# Altium project STM32MP25XXAK_LPDDR4.PrjPcb (part 1 of 2)
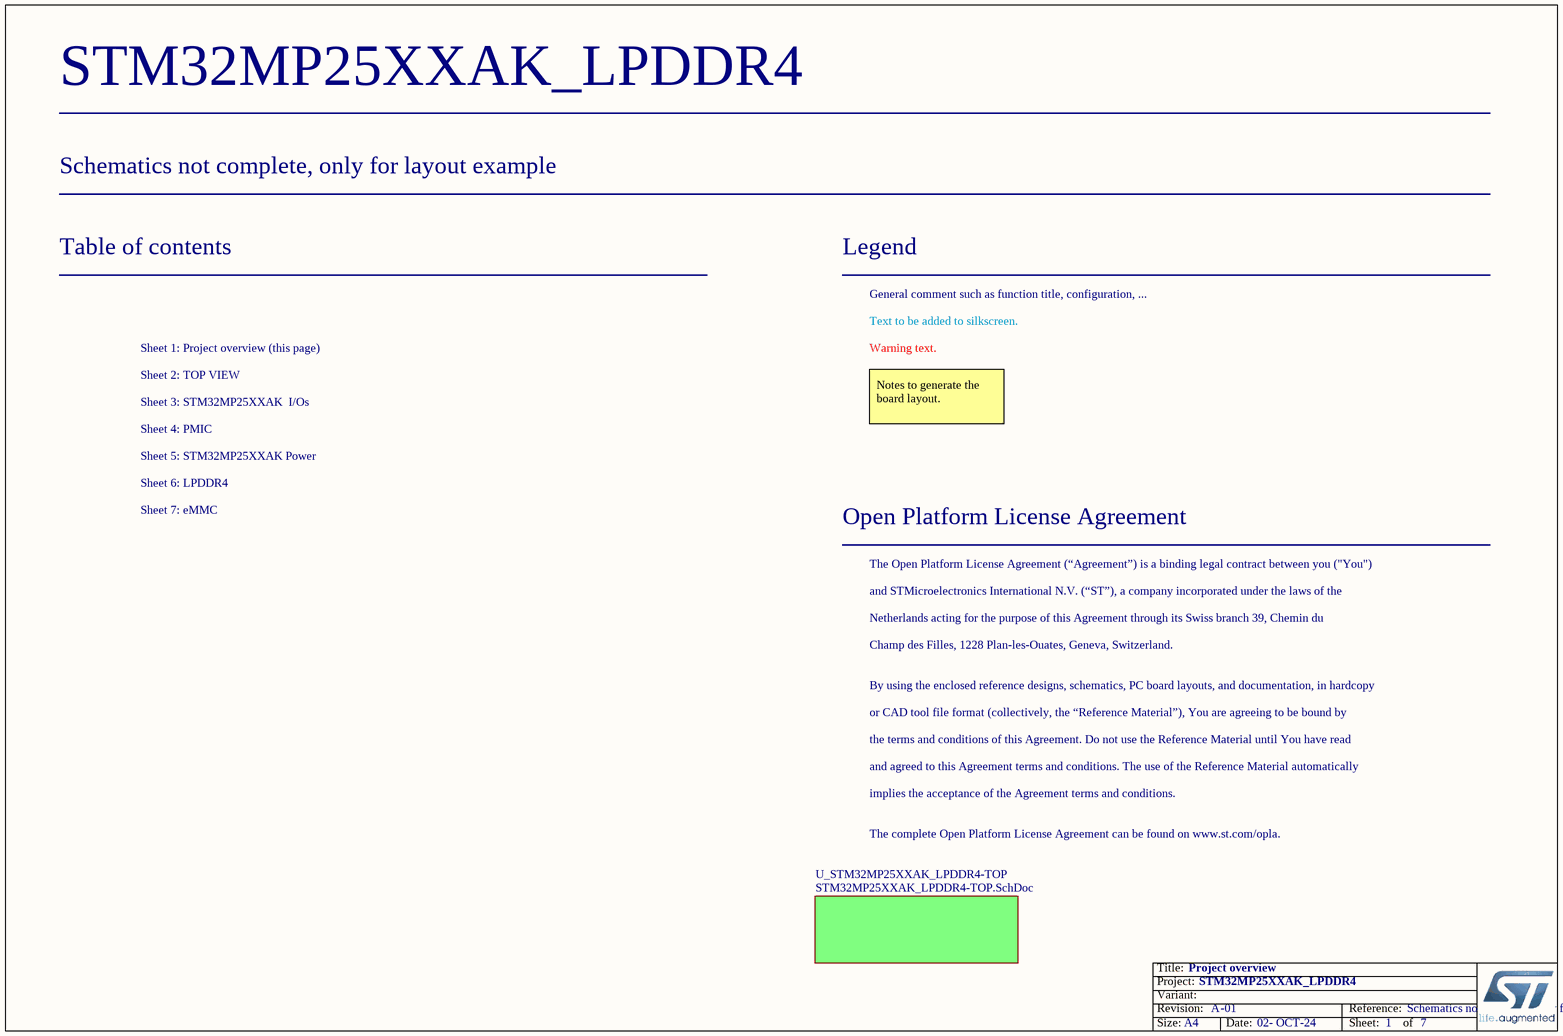
[diagram p0: STM32MP25XXAK_LPDDR4_Project_Overview.SchDoc]
Board_Reference: Schematics not complete, only for layout example; Board_PCB_Revision: A; Board_Name: STM32MP25XXAK_LPDDR4; Board_Document_Date: 02- OCT-24; Board_Assembly_Revision: 01
7 sheets, 190 parts. Net scope: flat (ports and power ports of the same name join across sheets).
Board file: STM32MP25XXAK_LPDDR4.PcbDoc
Sheets:
  STM32MP25XXAK_LPDDR4_Project_Overview.SchDoc
    U_STM32MP25XXAK_LPDDR4-TOP = STM32MP25XXAK_LPDDR4-TOP.SchDoc
      U_STM32MP25XXAK I_Os = STM32MP25XXAK I_Os.SchDoc
      U_PMIC = PMIC.SchDoc
      U_STM32MP25XXAK Power = STM32MP25XXAK Power.SchDoc
      U_LPDDR4 = LPDDR4.SchDoc
      U_eMMC = eMMC.SchDoc

## Sheet STM32MP25XXAK_LPDDR4_Project_Overview.SchDoc: Project overview
size A4; Date: Not used; ApprovedBy: Not used; CheckedBy: Not used; Author: Not used; CompanyName: STMicroelectronics; DrawnBy: Not used; Engineer: Not used; Organization: Not used; Address1: Not used; Address2: Not used; Address3: Not used; Address4: Not used; DocumentNumber: Not used; Revision: Not used; SheetNumber: 1; SheetTotal: 7; CurrentTime: Not used; CurrentDate: Not used; Time: Not used; DocumentFullPathAndName: Not used; DocumentName: Not used; ModifiedDate: Not used; ImagePath: Not used; ProjectName: Not used; Application_BuildNumber: Not used

### Sub-sheets
U_STM32MP25XXAK_LPDDR4-TOP = STM32MP25XXAK_LPDDR4-TOP.SchDoc: no entries

### Notes on the sheet
- Table of contents
- Legend
- General comment such as function title, configuration, ...
- Sheet 1: Project overview (this page)
- Sheet 2: TOP VIEW
- Text to be added to silkscreen.
- Warning text.
- Sheet 3: STM32MP25XXAK  I/Os
- Sheet 4: PMIC
- Notes to generate the board layout.
- Sheet 5: STM32MP25XXAK Power
- Sheet 7: eMMC
- Sheet 6: LPDDR4
- Open Platform License Agreement
- The Open Platform License Agreement (“Agreement”) is a binding legal contract between you ("You")
- and STMicroelectronics International N.V. (“ST”), a company incorporated under the laws of the
- Netherlands acting for the purpose of this Agreement through its Swiss branch 39, Chemin du
- Champ des Filles, 1228 Plan-les-Ouates, Geneva, Switzerland.
- By using the enclosed reference designs, schematics, PC board layouts, and documentation, in hardcopy
- or CAD tool file format (collectively, the “Reference Material”), You are agreeing to be bound by
- the terms and conditions of this Agreement. Do not use the Reference Material until You have read
- and agreed to this Agreement terms and conditions. The use of the Reference Material automatically
- implies the acceptance of the Agreement terms and conditions.
- The complete Open Platform License Agreement can be found on www.st.com/opla.
- Title:
- Project:
- Size:
- Revision:
- Variant:
- A4
- -
- Date:
- Reference:
- Sheet:
- of

## Sheet STM32MP25XXAK_LPDDR4-TOP.SchDoc: STM32MP25XXAK-TOP
size A3; Date: Not used; ApprovedBy: Not used; CheckedBy: Not used; Author: Not used; CompanyName: STMicroelectronics; DrawnBy: Not used; Engineer: Not used; Organization: Not used; Address1: Not used; Address2: Not used; Address3: Not used; Address4: Not used; DocumentNumber: Not used; Revision: Not used; SheetNumber: 2; SheetTotal: 7; CurrentTime: Not used; CurrentDate: Not used; Time: Not used; DocumentFullPathAndName: Not used; DocumentName: Not used; ModifiedDate: Not used; ImagePath: Not used; ProjectName: Not used; Application_BuildNumber: Not used
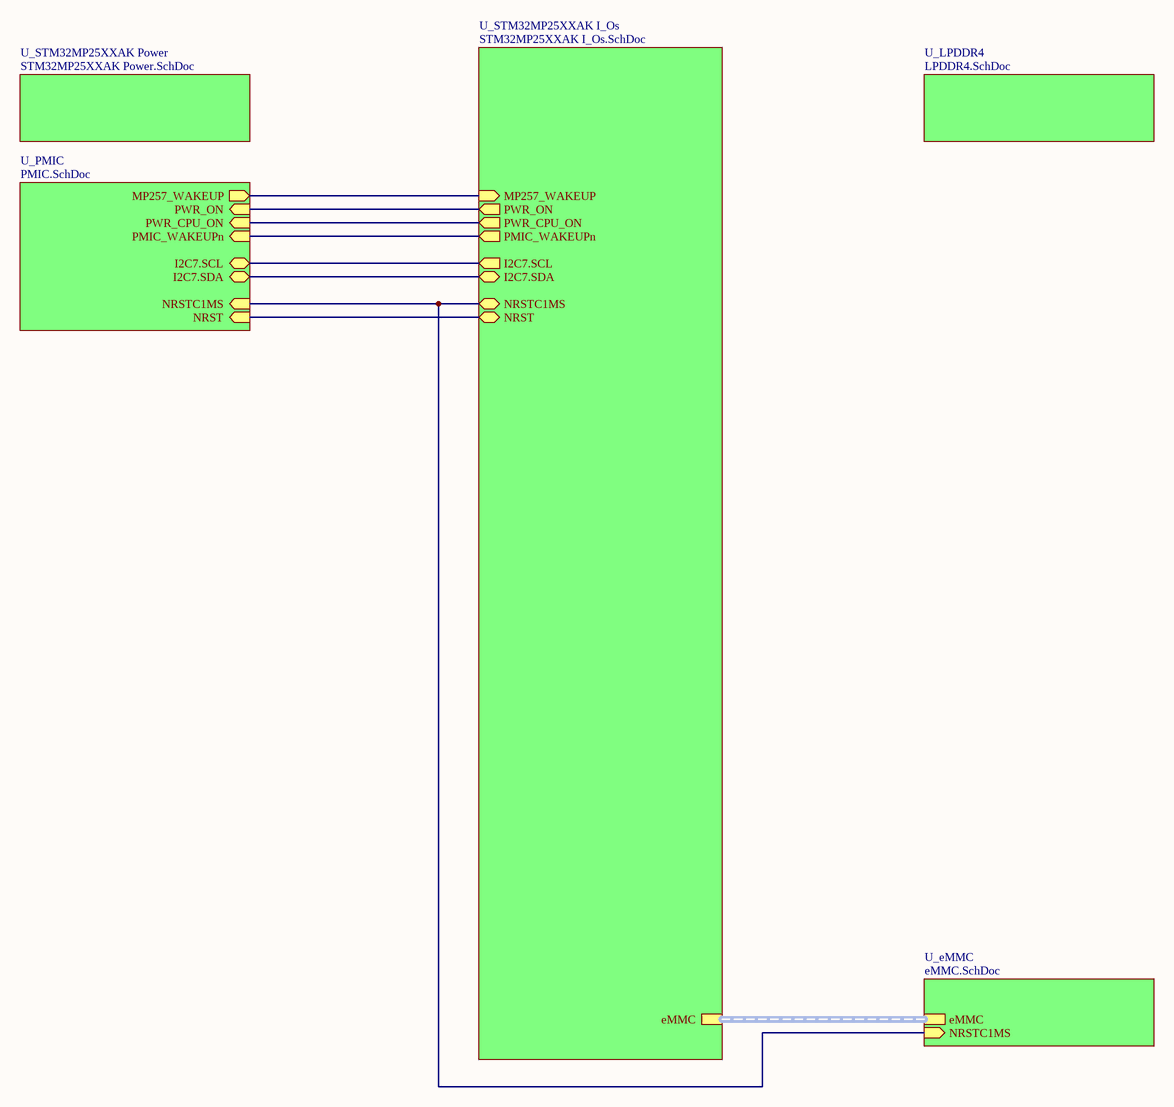
[diagram p1: STM32MP25XXAK_LPDDR4-TOP.SchDoc]

### Sub-sheets
U_eMMC = eMMC.SchDoc: eMMC (harness eMMC), NRSTC1MS (in)
U_LPDDR4 = LPDDR4.SchDoc: no entries
U_PMIC = PMIC.SchDoc: PMIC_WAKEUPn (in), NRST (in), I2C7.SCL (bidir), PWR_ON (in), PWR_CPU_ON (in), NRSTC1MS (in), I2C7.SDA (bidir), MP257_WAKEUP (out)
U_STM32MP25XXAK I_Os = STM32MP25XXAK I_Os.SchDoc: NRST (bidir), PWR_ON (out), NRSTC1MS (bidir), I2C7.SDA (bidir), I2C7.SCL (out), PWR_CPU_ON (out), MP257_WAKEUP (in), PMIC_WAKEUPn (out), eMMC (harness eMMC)
U_STM32MP25XXAK Power = STM32MP25XXAK Power.SchDoc: no entries

### Nets
(unnamed): sheet U_STM32MP25XXAK I_Os/NRST, sheet U_PMIC/NRST
(unnamed): sheet U_STM32MP25XXAK I_Os/PWR_ON, sheet U_PMIC/PWR_ON
(unnamed): sheet U_STM32MP25XXAK I_Os/NRSTC1MS, sheet U_PMIC/NRSTC1MS, sheet U_eMMC/NRSTC1MS
(unnamed): sheet U_STM32MP25XXAK I_Os/I2C7.SDA, sheet U_PMIC/I2C7.SDA
(unnamed): sheet U_STM32MP25XXAK I_Os/I2C7.SCL, sheet U_PMIC/I2C7.SCL
(unnamed): sheet U_STM32MP25XXAK I_Os/PWR_CPU_ON, sheet U_PMIC/PWR_CPU_ON
(unnamed): sheet U_STM32MP25XXAK I_Os/MP257_WAKEUP, sheet U_PMIC/MP257_WAKEUP
(unnamed): sheet U_STM32MP25XXAK I_Os/PMIC_WAKEUPn, sheet U_PMIC/PMIC_WAKEUPn

### Buses and harness runs
harness sheet U_eMMC/eMMC = sheet U_STM32MP25XXAK I_Os/eMMC

### Notes on the sheet
- Title:
- Project:
- Size:
- Revision:
- Variant:
- A3
- -
- Date:
- Reference:
- Sheet:
- of

## Sheet STM32MP25XXAK I_Os.SchDoc: STM32MP25XXAK  I/Os
size A3; Date: Not used; ApprovedBy: Not used; CheckedBy: Not used; Author: Not used; CompanyName: STMicroelectronics; DrawnBy: Not used; Engineer: Not used; Organization: Not used; Address1: Not used; Address2: Not used; Address3: Not used; Address4: Not used; DocumentNumber: Not used; Revision: Not used; SheetNumber: 3; SheetTotal: 7; CurrentTime: Not used; CurrentDate: Not used; Time: Not used; DocumentFullPathAndName: Not used; DocumentName: Not used; ModifiedDate: Not used; ImagePath: Not used; ProjectName: Not used; Application_BuildNumber: Not used
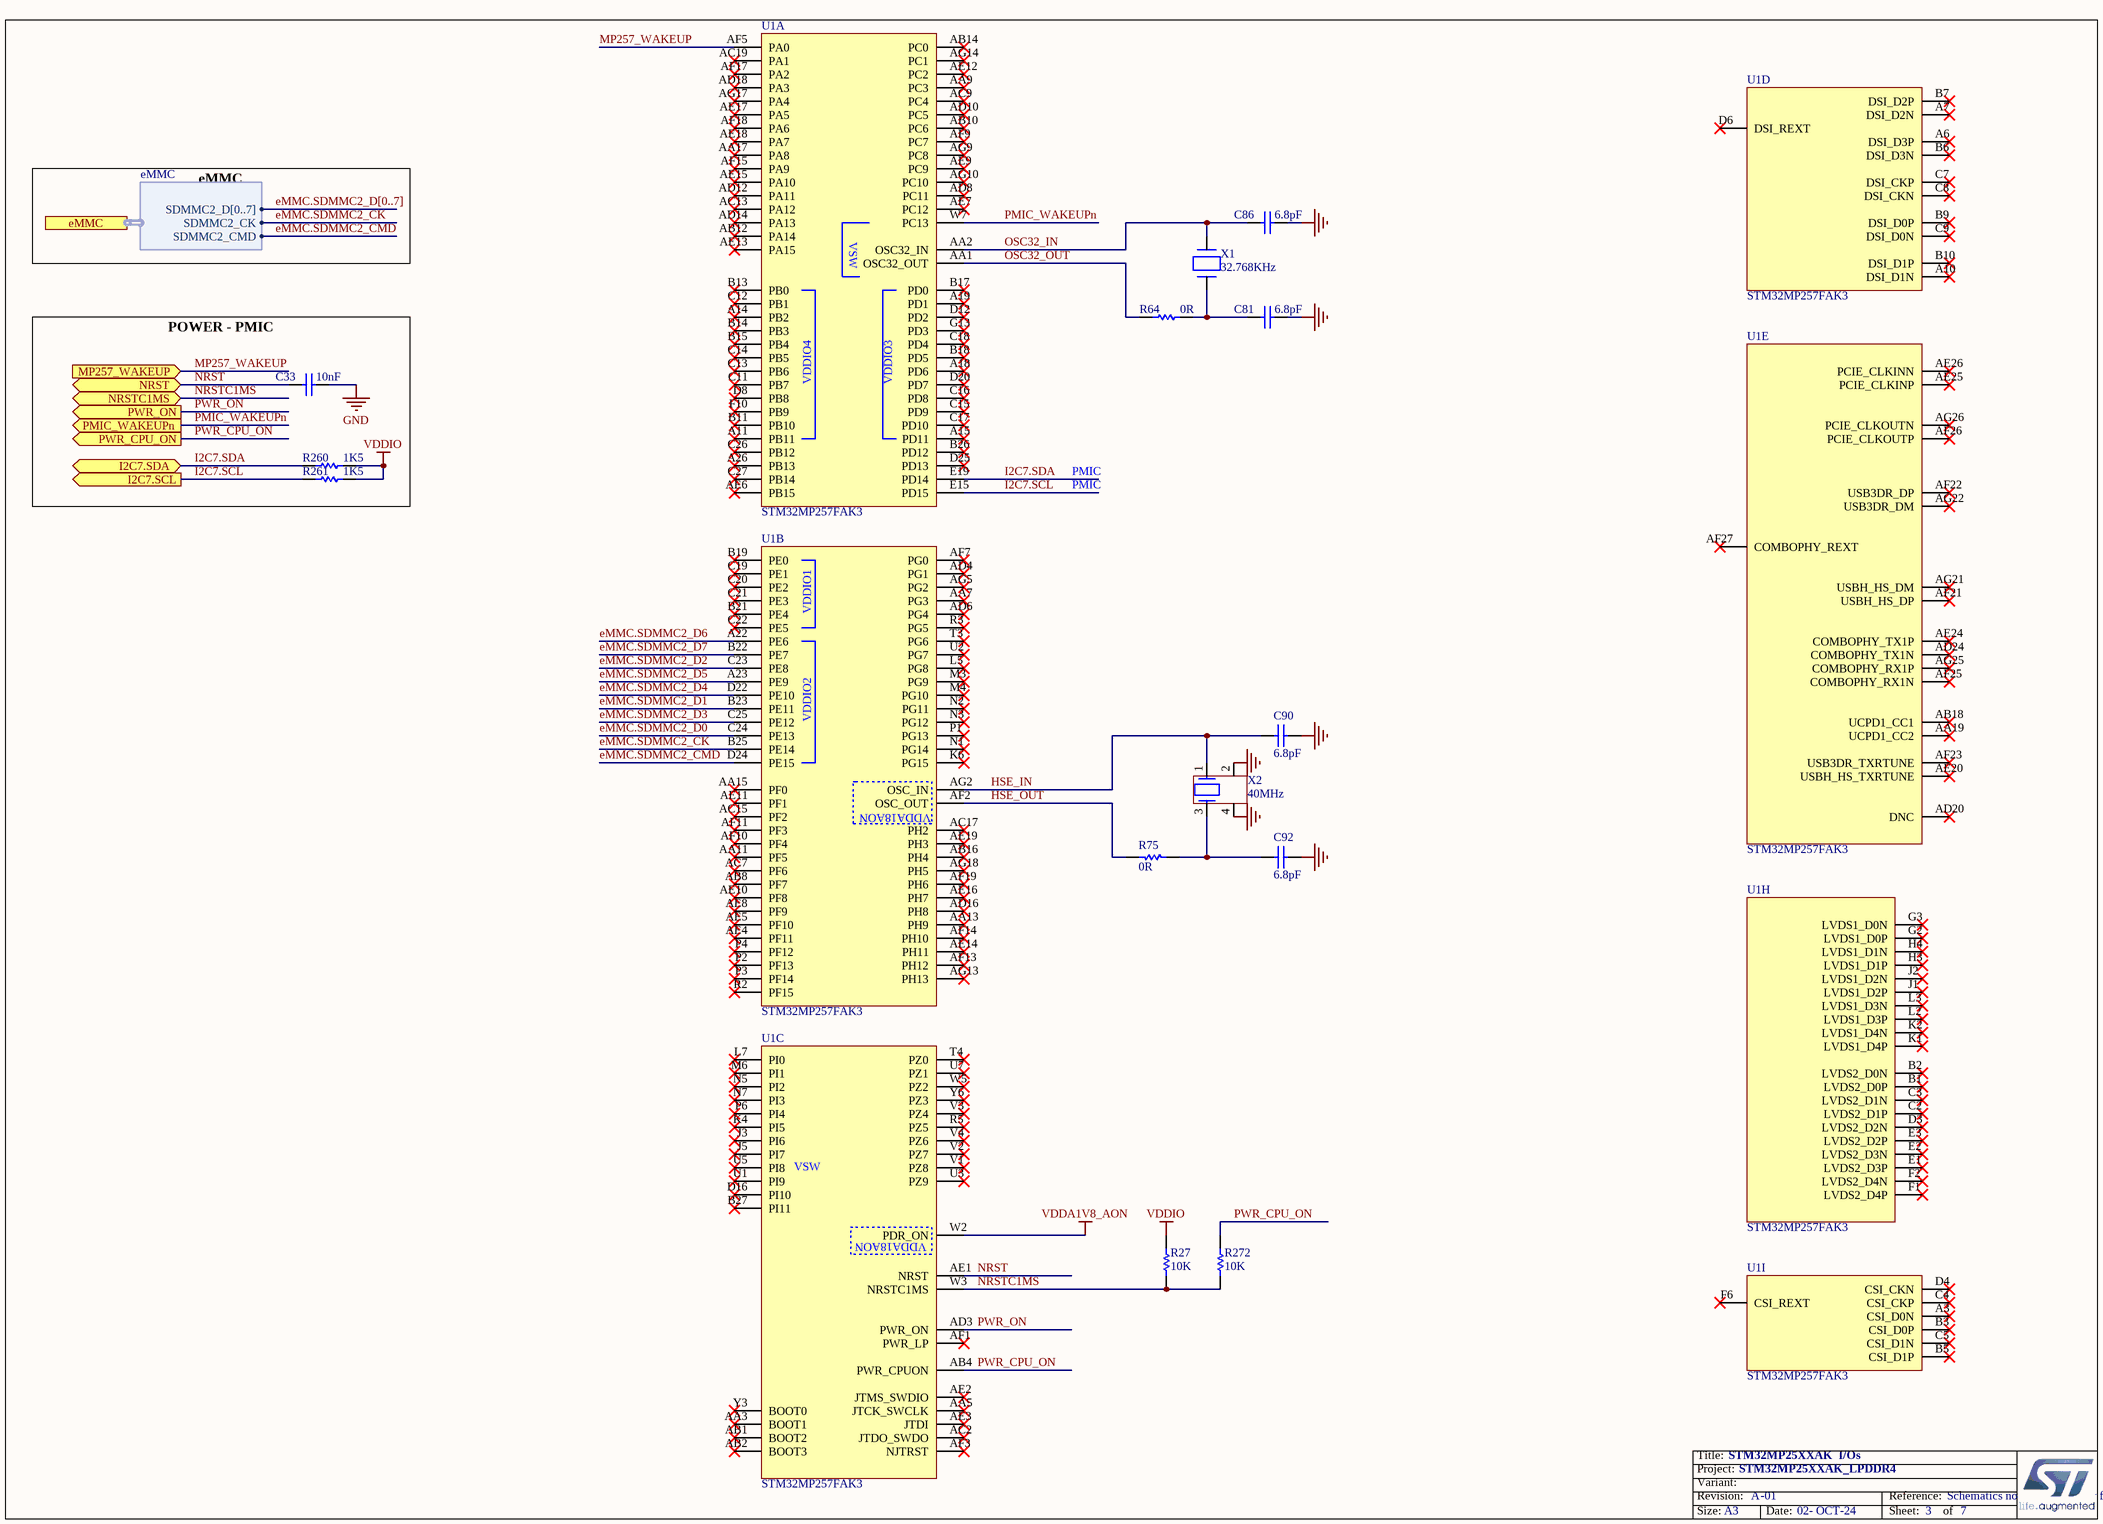
[diagram p2: STM32MP25XXAK I_Os.SchDoc]

### Parts
C33  value 10nF  [C0402]  (hidden comment: Capacitor)
C81  value 6.8pF  [C0402]  (hidden comment: Capacitor)
C86  value 6.8pF  [C0402]  (hidden comment: Capacitor)
C90  value 6.8pF  [C0402]  (hidden comment: Capacitor)
C92  value 6.8pF  [C0402]  (hidden comment: Capacitor)
R27  value 10K  [R0402]  (hidden comment: Resistor)
R64  value 0R  [R0402]
R75  value 0R  [R0402]
R260  value 1K5  [R0402]  (hidden comment: Resistor)
R261  value 1K5  [R0402]  (hidden comment: Resistor)
R272  value 10K  [R0402]  (hidden comment: Resistor)
U1  STM32MP257FAK3  [ICC_TFBGA424_14X14_P050_H1P20_CODE-B0A2]  (parts A,B,C,D,E,H,I of 9)
X1  value 32.768KHz  [CRY_NX2012SA_2P]  (hidden comment: XTAL_2_PINS)
X2  value 40MHz  [CRY_NX1612SA_4P]  (hidden comment: XTAL_4_PINS)

### Ports
eMMC (harness eMMC), I2C7.SCL (out), I2C7.SDA (bidir), MP257_WAKEUP (in), NRST (bidir), NRSTC1MS (bidir), PMIC_WAKEUPn (out), PWR_CPU_ON (out), PWR_ON (out)

### Harnesses
eMMC: SDMMC2_CK, SDMMC2_CMD, SDMMC2_D[0..7]

### Nets
GND: C33.1 C81.2 C86.2 C90.1 C92.2 X2.2 X2.4
VDDA1V8_AON: U1.W2(PDR_ON)
VDDIO: R27.2 R260.2 R261.2
eMMC.SDMMC2_CK: U1.B25(PE14) ; port eMMC.SDMMC2_CK
eMMC.SDMMC2_CMD: U1.D24(PE15) ; port eMMC.SDMMC2_CMD
eMMC.SDMMC2_D0: U1.C24(PE13)
eMMC.SDMMC2_D1: U1.B23(PE11)
eMMC.SDMMC2_D2: U1.C23(PE8)
eMMC.SDMMC2_D3: U1.C25(PE12)
eMMC.SDMMC2_D4: U1.D22(PE10)
eMMC.SDMMC2_D5: U1.A23(PE9)
eMMC.SDMMC2_D6: U1.A22(PE6)
eMMC.SDMMC2_D7: U1.B22(PE7)
HSE_IN: C90.2 U1.AG2(OSC_IN) X2.1
HSE_OUT: R75.2 U1.AF2(OSC_OUT)
I2C7.SCL: R261.1 U1.E15(PD15) ; port I2C7.SCL
I2C7.SDA: R260.1 U1.E19(PD14) ; port I2C7.SDA
MP257_WAKEUP: U1.AF5(PA0) ; port MP257_WAKEUP
NRST: C33.2 U1.AE1(NRST) ; port NRST
NRSTC1MS: R27.1 R272.1 U1.W3(NRSTC1MS) ; port NRSTC1MS
OSC32_IN: C86.1 U1.AA2(OSC32_IN) X1.2(X2)
OSC32_OUT: R64.1 U1.AA1(OSC32_OUT)
PMIC_WAKEUPn: U1.W7(PC13) ; port PMIC_WAKEUPn
PWR_CPU_ON: R272.2 U1.AB4(PWR_CPUON) ; port PWR_CPU_ON
PWR_ON: U1.AD3(PWR_ON) ; port PWR_ON
NetC81_1: C81.1 R64.2 X1.1(X1)
NetC92_1: C92.1 R75.1 X2.3

Not connected (* = marked no-connect by the designer): U1 A3(CSI_D0N)* A6(DSI_D3P)* A7(DSI_D2N)* A10(DSI_D1N)* A11(PB11)* A14(PB2)* A15(PD11)* A18(PD6)* A19(PD1)* A26(PB13)* AA3(BOOT1)* AA5(JTCK_SWCLK)* AA7(PG3)* AA9(PC3)* AA11(PF5)* AA13(PH9)* AA15(PF0)* AA17(PA8)* AA19(UCPD1_CC2)* AB1(BOOT2)* AB2(BOOT3)* AB8(PF7)* AB10(PC6)* AB12(PA14)* AB14(PC0)* AB16(PH4)* AB18(UCPD1_CC1)* AC2(JTDO_SWDO)* AC7(PF6)* AC9(PC4)* AC13(PA12)* AC15(PF2)* AC17(PH2)* AC19(PA1)* AD4(PG1)* AD6(PG4)* AD8(PC11)* AD10(PC5)* AD12(PA11)* AD14(PA13)* AD16(PH8)* AD18(PA3)* AD20(DNC)* AD24(COMBOPHY_TX1N)* AE2(JTMS_SWDIO)* AE3(JTDI)* AE4(PF11)* AE5(PF10)* AE6(PB15)* AE7(PC12)* AE8(PF9)* AE9(PC9)* AE10(PF8)* AE11(PF1)* AE12(PC2)* AE13(PA15)* AE14(PH11)* AE15(PA10)* AE16(PH7)* AE17(PA5)* AE18(PA7)* AE19(PH3)* AE20(USBH_HS_TXRTUNE)* AE24(COMBOPHY_TX1P)* AE25(PCIE_CLKINP)* AE26(PCIE_CLKINN)* AF1(PWR_LP)* AF3(NJTRST)* AF7(PG0)* AF9(PC7)* AF10(PF4)* AF11(PF3)* AF13(PH12)* AF14(PH10)* AF15(PA9)* AF17(PA2)* AF18(PA6)* AF19(PH6)* AF21(USBH_HS_DP)* AF22(USB3DR_DP)* AF23(USB3DR_TXRTUNE)* AF25(COMBOPHY_RX1N)* AF26(PCIE_CLKOUTP)* AF27(COMBOPHY_REXT)* AG5(PG2)* AG9(PC8)* AG10(PC10)* AG13(PH13)* AG14(PC1)* AG17(PA4)* AG18(PH5)* AG21(USBH_HS_DM)* AG22(USB3DR_DM)* AG25(COMBOPHY_RX1P)* AG26(PCIE_CLKOUTN)* B1(LVDS2_D0P)* B2(LVDS2_D0N)* B3(CSI_D0P)* B5(CSI_D1P)* B6(DSI_D3N)* B7(DSI_D2P)* B9(DSI_D0P)* B10(DSI_D1P)* B11(PB10)* B13(PB0)* B14(PB3)* B15(PB4)* B17(PD0)* B18(PD5)* B19(PE0)* B21(PE4)* B26(PD12)* B27(PI11)* C2(LVDS2_D1P)* C3(LVDS2_D1N)* C4(CSI_CKP)* C5(CSI_D1N)* C7(DSI_CKP)* C8(DSI_CKN)* C9(DSI_D0N)* C11(PB7)* C12(PB1)* C13(PB6)* C14(PB5)* C15(PD9)* C16(PD8)* C17(PD10)* C18(PD4)* C19(PE1)* C20(PE2)* C21(PE3)* C22(PE5)* C26(PB12)* C27(PB14)* D3(LVDS2_D2N)* D4(CSI_CKN)* D6(DSI_REXT)* D8(PB8)* D12(PD2)* D16(PI10)* D20(PD7)* D25(PD13)* E1(LVDS2_D3P)* E2(LVDS2_D3N)* E3(LVDS2_D2P)* F1(LVDS2_D4P)* F2(LVDS2_D4N)* F6(CSI_REXT)* F10(PB9)* G2(LVDS1_D0P)* G3(LVDS1_D0N)* G13(PD3)* H3(LVDS1_D1P)* H4(LVDS1_D1N)* J1(LVDS1_D2P)* J2(LVDS1_D2N)* J3(PI6)* J5(PI7)* K1(LVDS1_D4P)* K2(LVDS1_D4N)* K4(PI5)* K6(PG15)* L2(LVDS1_D3P)* L3(LVDS1_D3N)* L5(PG8)* L7(PI0)* M3(PG9)* M4(PG10)* M6(PI1)* N1(PG14)* N2(PG11)* N3(PG12)* N5(PI2)* N7(PI3)* P1(PG13)* P2(PF13)* P3(PF14)* P4(PF12)* P6(PI4)* R2(PF15)* R3(PG5)* R5(PZ5)* T3(PG6)* T4(PZ0)* U1(PI9)* U2(PG7)* U3(PZ9)* U5(PI8)* U7(PZ1)* V1(PZ8)* V2(PZ7)* V3(PZ4)* V4(PZ6)* W5(PZ2)* Y3(BOOT0)* Y6(PZ3)*

### Buses and harness runs
bus eMMC.SDMMC2_D[0..7]

### Notes on the sheet
- eMMC
- POWER - PMIC
- PMIC
- Title:
- Project:
- Size:
- Revision:
- Variant:
- A3
- -
- Date:
- Reference:
- Sheet:
- of
- (in symbol MCD-03375, part A) VSW
- (in symbol MCD-03375, part C) VSW

### Library data of the parts
C33 = MCD-00011: Capacitor, MLCC, 10nF, 16V, X7R, 10%, 0402, T=0.5mm; Manufacturer_Part_Number: CC0402KRX7R7BB103; Manufacturer: YAGEO; Provided_By: SUBCO; Initial_Board_Reference: MB1274; Internal_Part_Number: MCD-00011; Status: Released; Part_Type: Capacitor; Package: C0402; ComponentLink1Description: Datasheet; ComponentLink1URL: http://tunmcdsvn.tun.st.com/Component_Datasheet_Library/Trunk/Capacitors/Yageo_Multilayer_Capacitor_X7R_series_100pF_to_22uF; ECCN_US: n/a; ECCN_EU: n/a
C81 C86 = MCD-00674: Capacitor, MLCC, 6.8pF, 50V, NPO, +-0.25pF, 0402, T=0.5mm; Manufacturer_Part_Number: CC0402CRNPO9BN6R8; Manufacturer: YAGEO; Part_Preference: Recommended; Provided_By: SUBCO; Initial_Board_Reference: MB1319; Path: ws/MCD_ApplicationBoards/Lists/MCDPARTSdatabase; Item Type: Item; Component_Country_Of_Origin: China; ID: 3068; ShowFields: YES; Internal_Part_Number: MCD-00674; Status: Released; Part_Type: Capacitor; Package: 0402; ComponentLink1Description: Datasheet; ComponentLink1URL: http://tunmcdsvn.tun.st.com/Component_Documentation_Library/Trunk/Capacitor/YAGEO_NP0_Series; Alternate_Manufacturer: N/A; Alternate_Manufacturer_Part_Number: N/A; Order_Code_Digikey: 311-3327-1-ND; Order_Code_Farnell: N/A; Order_Code_RS: N/A
C90 C92 = MCD-00674: Capacitor, MLCC, 6.8pF, 50V, NPO, +-0.25pF, 0402, T=0.5mm; Manufacturer_Part_Number: CC0402CRNPO9BN6R8; Manufacturer: YAGEO; Part_Preference: Recommended; Provided_By: SUBCO; Initial_Board_Reference: MB1319; Component_Country_Of_Origin: China; ID: 3068; ShowFields: YES; Internal_Part_Number: MCD-00674; Status: Released; Part_Type: Capacitor; Package: 0402; ComponentLink1Description: Datasheet; ComponentLink1URL: http://tunmcdsvn.tun.st.com/Component_Documentation_Library/Trunk/Capacitor/YAGEO_NP0_Series; ECCN_US: n/a; ECCN_EU: n/a; Alternate_Manufacturer: N/A; Alternate_Manufacturer_Part_Number: N/A; Order_Code_Digikey: 311-3327-1-ND; Order_Code_Farnell: N/A; Order_Code_RS: N/A
R27 R272 = MCD-00053: Resistor,10K,0402,1%,1/16W; BMS_Part_Number: 9131590; Part_Preference: Recommended; Manufacturer: YAGEO; Manufacturer_Part_Number: RC0402FR-0710KL; Component_Country_Of_Origin: China; ID: 2539; ShowFields: YES; Internal_Part_Number: MCD-00053; Status: Released; Part_Type: Resistor; Package: 0402; ComponentLink1Description: Datasheet; ComponentLink1URL: http://tunmcdsvn.tun.st.com/Component_Documentation_Library/Trunk/Resistor/YAGEO_RC_L_Series; Order_Code_Digikey: 311-10.0KLRCT-ND; Order_Code_Farnell: 9239359; Order_Code_RS: N/A; Alternate_Manufacturer: N/A; Alternate_Manufacturer_Part_Number: N/A
R64 R75 = MCD-00052: Resistor,0R,0402,5%,1/16W; Manufacturer_Part_Number: RC0402JR-070RL; Manufacturer: YAGEO; Part_Preference: Recommended; Provided_By: SUBCO; Initial_Board_Reference: mb1274; Order_Code_RS: 618-5804; Component_Country_Of_Origin: China; ID: 2540; ShowFields: YES; Internal_Part_Number: MCD-00052; ComponentLink1Description: Datasheet; ECCN_US: n/a; ECCN_EU: n/a; Status: Released; Part_Type: Resistor; ComponentLink1URL: http://tunmcdsvn.tun.st.com/Component_Documentation_Library/Trunk/Resistor/YAGEO_RC_L_Series; Package: 0402; Alternate_Manufacturer: N/A; Alternate_Manufacturer_Part_Number: N/A; Order_Code_Digikey: 311-0.0JRCT-ND; Order_Code_Farnell: 9232516RL
R260 R261 = MCD-00068: Resistor,1K5,0402,1%,1/16W; Part_Preference: Recommended; Manufacturer: YAGEO; Manufacturer_Part_Number: RC0402FR-071K5L; Component_Country_Of_Origin: China; ID: 2524; ShowFields: YES; Internal_Part_Number: MCD-00068; Status: Released; Part_Type: Resistor; Package: 0402; ComponentLink1Description: Datasheet; ComponentLink1URL: http://tunmcdsvn.tun.st.com/Component_Documentation_Library/Trunk/Resistor/YAGEO_RC_L_Series; Order_Code_Digikey: 311-1.50KLRCT-ND; Order_Code_Farnell: 9239251; Order_Code_RS: N/A
U1 = MCD-03375: MPU , 2xCortex-A35@1.5GHz, Cortex-M33@400MHz, TFBGA 14x14, pitch 0.5, 808 KB SRAM, With Crypto; Part_Type: IC; Part_Preference: Recommended; Manufacturer: STMICROELECTRONICS; Component_Country_Of_Origin: Unknown; ShowFields: YES; ID: 5491; Internal_Part_Number: MCD-03375; Value: STM32MP257FAK3; Status: Checked; Manufacturer_Part_Number: STM32MP257FAK3; Package: TFBGA; ComponentLink1URL: http://tunmcdsvn.tun.st.com/Component_Documentation_Library/Trunk/IC/STMICROELECTRONICS_STM32MP257FAK3; Order_Code_Digikey: N/A; Order_Code_Farnell: N/A; Order_Code_RS: N/A
X1 = MCD-01479: Crystal, 32.768kHz, 6pF, +/-20ppm, 80K, 2.05x1.2mm; BMS_Part_Number: 9157049; Part_Type: Crystal_Osc; Part_Preference: Recommended; Manufacturer: NDK; Manufacturer_Part_Number: NX2012SA-32.768KHZ-EXS00A-MU00527; Component_Country_Of_Origin: Unknown; ShowFields: YES; ID: 3579; Internal_Part_Number: MCD-01479; Status: Released; Package: 2.05x1.2mm; ComponentLink1URL: http://tunmcdsvn.tun.st.com/Component_Documentation_Library/Trunk/Crytal_Oscillator/NDK_NX2012SA_Series; Order_Code_Digikey: 644-1352; Order_Code_Farnell: N/A; Order_Code_RS: N/A
X2 = MCD-02344: Crystal, 40MHz, 6pF, +/-20ppm, 80R, 1.6x1.2mm; Part_Type: Crystal_Osc; Part_Preference: Recommended; Manufacturer: NDK; Manufacturer_Part_Number: NX1612SA-40MHZ-EXS00A-CS13836; Component_Country_Of_Origin: Unknown; ShowFields: YES; ID: 4450; Internal_Part_Number: MCD-02344; Status: Checked; Package: 1.6x1.2mm; ComponentLink1URL: http://tunmcdsvn.tun.st.com/Component_Documentation_Library/Trunk/Crytal_Oscillator/NDK_NX1612SA_Series/; Order_Code_Digikey: N/A; Order_Code_Farnell: N/A; Order_Code_RS: N/A

## Sheet PMIC.SchDoc: Power PMIC
size A3; Date: Not used; ApprovedBy: Not used; CheckedBy: Not used; Author: Not used; CompanyName: STMicroelectronics; DrawnBy: Not used; Engineer: Not used; Organization: Not used; Address1: Not used; Address2: Not used; Address3: Not used; Address4: Not used; DocumentNumber: Not used; Revision: Not used; SheetNumber: 4; SheetTotal: 7; CurrentTime: Not used; CurrentDate: Not used; Time: Not used; DocumentFullPathAndName: Not used; DocumentName: Not used; ModifiedDate: Not used; ImagePath: Not used; ProjectName: Not used; Application_BuildNumber: Not used
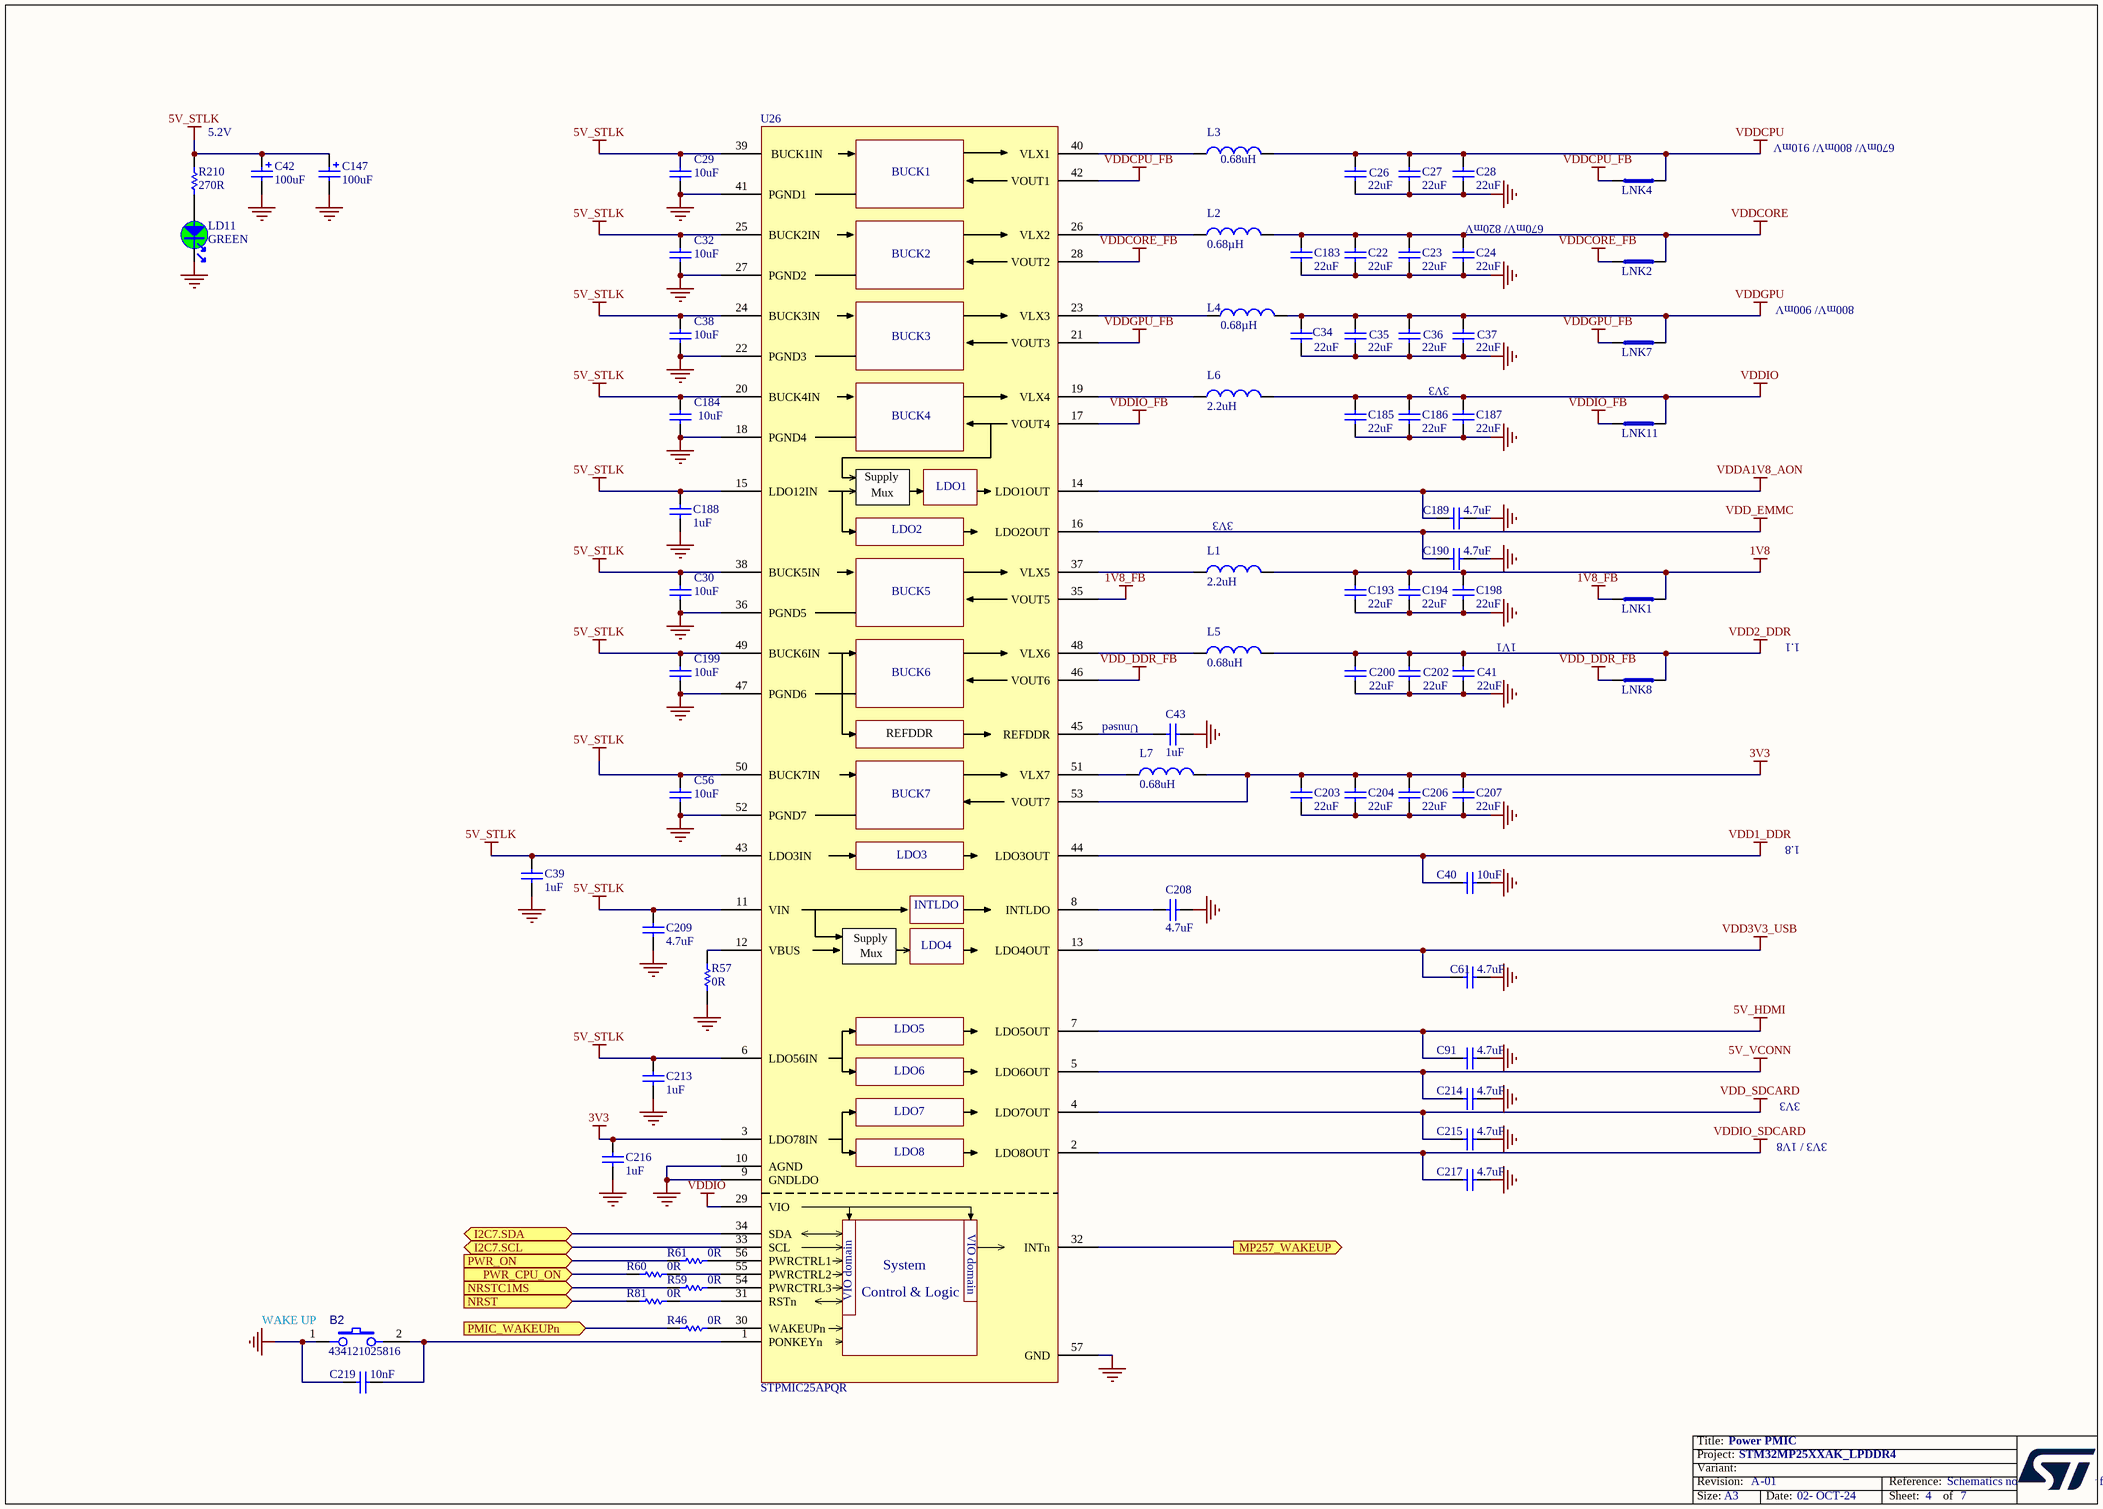
[diagram p3: PMIC.SchDoc]

### Parts
B2  value 434121025816  [SWI_WE_434121025816]  (hidden comment: SW_PUSH_SMD_2P)
C22  value 22uF  [C0603]  (hidden comment: Capacitor)
C23  value 22uF  [C0603]  (hidden comment: Capacitor)
C24  value 22uF  [C0603]  (hidden comment: Capacitor)
C26  value 22uF  [C0603]  (hidden comment: Capacitor)
C27  value 22uF  [C0603]  (hidden comment: Capacitor)
C28  value 22uF  [C0603]  (hidden comment: Capacitor)
C29  value 10uF  [C0603]  (hidden comment: Capacitor)
C30  value 10uF  [C0603]  (hidden comment: Capacitor)
C32  value 10uF  [C0603]  (hidden comment: Capacitor)
C34  value 22uF  [C0603]  (hidden comment: Capacitor)
C35  value 22uF  [C0603]  (hidden comment: Capacitor)
C36  value 22uF  [C0603]  (hidden comment: Capacitor)
C37  value 22uF  [C0603]  (hidden comment: Capacitor)
C38  value 10uF  [C0603]  (hidden comment: Capacitor)
C39  value 1uF  [C0402]  (hidden comment: Capacitor)
C40  value 10uF  [C0402]  (hidden comment: Capacitor)
C41  value 22uF  [C0603]  (hidden comment: Capacitor)
C42  value 100uF  [CPOL_TCJ-B_1210_H210]  (hidden comment: Cap_POL_TANA)
C43  value 1uF  [C0402]  (hidden comment: Capacitor)
C56  value 10uF  [C0603]  (hidden comment: Capacitor)
C61  value 4.7uF  [C0402]  (hidden comment: Capacitor)
C91  value 4.7uF  [C0402]  (hidden comment: Capacitor)
C147  value 100uF  [CPOL_TCJ-B_1210_H210]  (hidden comment: Cap_POL_TANA)
C183  value 22uF  [C0603]  (hidden comment: Capacitor)
C184  value 10uF  [C0603]  (hidden comment: Capacitor)
C185  value 22uF  [C0805]  (hidden comment: Capacitor)
C186  value 22uF  [C0805]  (hidden comment: Capacitor)
C187  value 22uF  [C0805]  (hidden comment: Capacitor)
C188  value 1uF  [C0402]  (hidden comment: Capacitor)
C189  value 4.7uF  [C0402]  (hidden comment: Capacitor)
C190  value 4.7uF  [C0402]  (hidden comment: Capacitor)
C193  value 22uF  [C0805]  (hidden comment: Capacitor)
C194  value 22uF  [C0805]  (hidden comment: Capacitor)
C198  value 22uF  [C0805]  (hidden comment: Capacitor)
C199  value 10uF  [C0603]  (hidden comment: Capacitor)
C200  value 22uF  [C0603]  (hidden comment: Capacitor)
C202  value 22uF  [C0603]  (hidden comment: Capacitor)
C203  value 22uF  [C0805]  (hidden comment: Capacitor)
C204  value 22uF  [C0805]  (hidden comment: Capacitor)
C206  value 22uF  [C0805]  (hidden comment: Capacitor)
C207  value 22uF  [C0805]  (hidden comment: Capacitor)
C208  value 4.7uF  [C0402]  (hidden comment: Capacitor)
C209  value 4.7uF  [C0402]  (hidden comment: Capacitor)
C213  value 1uF  [C0402]  (hidden comment: Capacitor)
C214  value 4.7uF  [C0402]  (hidden comment: Capacitor)
C215  value 4.7uF  [C0402]  (hidden comment: Capacitor)
C216  value 1uF  [C0402]  (hidden comment: Capacitor)
C217  value 4.7uF  [C0402]  (hidden comment: Capacitor)
C219  value 10nF  [C0402]  (hidden comment: Capacitor)
L1  value 2.2uH  [IND_2016_MURATA_LQM2MPN2R2NG0]  (hidden comment: Inductor)
L2  value 0.68µH  [IND_2520_TOKO_DFE252012P]  (hidden comment: Inductor)
L3  value 0.68uH  [IND_2016_MURATA_LQM2MPN2R2NG0]  (hidden comment: Inductor)
L4  value 0.68µH  [IND_2520_TOKO_DFE252012P]  (hidden comment: Inductor)
L5  value 0.68uH  [IND_2016_MURATA_LQM2MPN2R2NG0]  (hidden comment: Inductor)
L6  value 2.2uH  [IND_2016_MURATA_LQM2MPN2R2NG0]  (hidden comment: Inductor)
L7  value 0.68uH  [IND_2016_MURATA_LQM2MPN2R2NG0]  (hidden comment: Inductor)
LD11  value GREEN  [LED_0603_OSRAM_LG-Q396-PS-35_GREEN_1A2K_H0P4]  (hidden comment: LED_green)
LNK1  link_200  [LINK200]  (value not drawn)  (no BOM)
LNK2  link_200  [LINK200]  (value not drawn)  (no BOM)
LNK4  link_200  [LINK200]  (value not drawn)  (no BOM)
LNK7  link_200  [LINK200]  (value not drawn)  (no BOM)
LNK8  link_200  [LINK200]  (value not drawn)  (no BOM)
LNK11  link_200  [LINK200]  (value not drawn)  (no BOM)
R46  value 0R  [R0402]
R57  value 0R  [R0402]
R59  value 0R  [R0402]
R60  value 0R  [R0402]
R61  value 0R  [R0402]
R81  value 0R  [R0402]
R210  value 270R  [R0402]  (hidden comment: Resistor)
U26  STPMIC25APQR  [ICC_QFN56-EPAD_6P5X6P5_P040]

### Ports
I2C7.SCL (bidir), I2C7.SDA (bidir), MP257_WAKEUP (out), NRST (in), NRSTC1MS (in), PMIC_WAKEUPn (in), PWR_CPU_ON (in), PWR_ON (in)

### Nets
1V8: C193.2 C194.2 C198.2 L1.2 LNK1.2
1V8_FB: LNK1.1 U26.35(VOUT5)
3V3: C203.2 C204.2 C206.2 C207.2 C216.2 L7.2 U26.3(LDO78IN) U26.53(VOUT7)
5V_HDMI: C91.1 U26.7(LDO5OUT)
5V_STLK: C29.2 C30.2 C32.2 C38.2 C39.2 C42.1 C56.2 C147.1 C184.2 C188.2 C199.2 C209.2 C213.2 R210.1 U26.6(LDO56IN) U26.11(VIN) U26.15(LDO12IN) U26.20(BUCK4IN) U26.24(BUCK3IN) U26.25(BUCK2IN) U26.38(BUCK5IN) U26.39(BUCK1IN) U26.43(LDO3IN) U26.49(BUCK6IN) U26.50(BUCK7IN)
5V_VCONN: C214.1 U26.5(LDO6OUT)
GND: B2.1 C22.1 C23.1 C24.1 C26.1 C27.1 C28.1 C29.1 C30.1 C32.1 C34.1 C35.1 C36.1 C37.1 C38.1 C39.1 C40.1 C41.1 C42.2 C43.1 C56.1 C61.1 C91.2 C147.2 C183.1 C184.1 C185.1 C186.1 C187.1 C188.1 C189.1 C190.2 C193.1 C194.1 C198.1 C199.1 C200.1 C202.1 C203.1 C204.1 C206.1 C207.1 C208.2 C209.1 C213.1 C214.2 C215.2 C216.1 C217.2 C219.1 LD11.2 R57.1 U26.9(GNDLDO) U26.10(AGND) U26.18(PGND4) U26.22(PGND3) U26.27(PGND2) U26.36(PGND5) U26.41(PGND1) U26.47(PGND6) U26.52(PGND7) U26.57(GND)
VDD1_DDR: C40.2 U26.44(LDO3OUT)
VDD2_DDR: C41.2 C200.2 C202.2 L5.2 LNK8.2
VDD3V3_USB: C61.2 U26.13(LDO4OUT)
VDD_DDR_FB: LNK8.1 U26.46(VOUT6)
VDD_EMMC: C190.1 U26.16(LDO2OUT)
VDD_SDCARD: C215.1 U26.4(LDO7OUT)
VDDA1V8_AON: C189.2 U26.14(LDO1OUT)
VDDCORE: C22.2 C23.2 C24.2 C183.2 L2.2 LNK2.2
VDDCORE_FB: LNK2.1 U26.28(VOUT2)
VDDCPU: C26.2 C27.2 C28.2 L3.2 LNK4.1
VDDCPU_FB: LNK4.2 U26.42(VOUT1)
VDDGPU: C34.2 C35.2 C36.2 C37.2 L4.2 LNK7.2
VDDGPU_FB: LNK7.1 U26.21(VOUT3)
VDDIO: C185.2 C186.2 C187.2 L6.2 LNK11.2 U26.29(VIO)
VDDIO_FB: LNK11.1 U26.17(VOUT4)
VDDIO_SDCARD: C217.1 U26.2(LDO8OUT)
I2C7.SCL: U26.33(SCL) ; port I2C7.SCL
I2C7.SDA: U26.34(SDA) ; port I2C7.SDA
MP257_WAKEUP: U26.32(INTn) ; port MP257_WAKEUP
NRST: R81.1 ; port NRST
NRSTC1MS: R59.1 ; port NRSTC1MS
PMIC_WAKEUPn: R46.1 ; port PMIC_WAKEUPn
PWR_CPU_ON: R60.1 ; port PWR_CPU_ON
PWR_ON: R61.1 ; port PWR_ON
NetB2_2: B2.2 C219.2 U26.1(PONKEYn)
NetC43_2: C43.2 U26.45(REFDDR)
NetC208_1: C208.1 U26.8(INTLDO)
NetL1_1: L1.1 U26.37(VLX5)
NetL2_1: L2.1 U26.26(VLX2)
NetL3_1: L3.1 U26.40(VLX1)
NetL4_1: L4.1 U26.23(VLX3)
NetL5_1: L5.1 U26.48(VLX6)
NetL6_1: L6.1 U26.19(VLX4)
NetL7_1: L7.1 U26.51(VLX7)
NetLD11_1: LD11.1 R210.2
NetR46_2: R46.2 U26.30(WAKEUPn)
NetR57_2: R57.2 U26.12(VBUS)
NetR59_2: R59.2 U26.54(PWRCTRL3)
NetR60_2: R60.2 U26.55(PWRCTRL2)
NetR61_2: R61.2 U26.56(PWRCTRL1)
NetR81_2: R81.2 U26.31(RSTn)

### Notes on the sheet
- 5.2V
- 670mV/ 800mV/ 910mV
- (near C24) 670mV/ 820mV
- 800mV/ 900mV
- 3V3
- (near L1) 3V3
- 1V1
- 1.1
- Unused
- 1.8
- 3V3 / 1V8
- (near B2) WAKE UP
- Title:
- Project:
- Size:
- Revision:
- Variant:
- A3
- -
- Date:
- Reference:
- Sheet:
- of
- (in symbol MCD-03000) BUCK1; BUCK2; BUCK3; BUCK4; Supply; LDO1; Mux; LDO2; BUCK5; BUCK6; BUCK7; LDO3; LDO4; LDO5; LDO6; LDO7; LDO8; VIO domain; System; Control & Logic

### Library data of the parts
B2 = MCD-03492: Switch tactile, SPST-NO, 50mA, 12V, 6x3.8mm; Part_Type: Misc; Part_Preference: Recommended; Manufacturer: WURTH ELEKTRONIC; Component_Country_Of_Origin: China°; ShowFields: YES; ID: 5608; Internal_Part_Number: MCD-03492; Status: Checked; Manufacturer_Part_Number: 434121025816; Package: 6x3.8mm; ComponentLink1URL: http://tunmcdsvn.tun.st.com/Component_Documentation_Library/Trunk/Misc/WURTH_ELECTRONIK_434121025816; Order_Code_Digikey: 732-7045-2-ND; Order_Code_Farnell: 1867991; Order_Code_RS: N/A
C22-C24 C26 C34-C37 C41 C200 C202 = MCD-00100: Capacitor, MLCC, 22uF, 6V3, X5R, +/-20%, 0603, T=0,8mm; Manufacturer_Part_Number: GRM188R60J226MEA0J; Manufacturer: MURATA; Part_Preference: Recommended; Component_Country_Of_Origin: Japan; ID: 2766; ShowFields: YES; Internal_Part_Number: MCD-00100; Status: Released; Part_Type: Capacitor; Package: 0603; ComponentLink1Description: Part_Information; ComponentLink1URL: http://tunmcdsvn.tun.st.com/Component_Documentation_Library/Trunk/Capacitor/MURATA_GRM_Series; Order_Code_Digikey: 490-7612-2-ND; Order_Code_Farnell: N/A; Order_Code_RS: N/A; Alternate_Manufacturer: N/A; Alternate_Manufacturer_Part_Number: N/A
C27 C28 C183 = MCD-00100: Capacitor, MLCC, 22uF, 6V3, X5R, +/-20%, 0603, T=0,8mm; Part_Preference: Recommended; Manufacturer: MURATA; Manufacturer_Part_Number: GRM188R60J226MEA0J; Component_Country_Of_Origin: Japan; ID: 2766; ShowFields: YES; Internal_Part_Number: MCD-00100; Status: Released; Part_Type: Capacitor; Package: 0603; ComponentLink1URL: http://tunmcdsvn.tun.st.com/Component_Documentation_Library/Trunk/Capacitor/MURATA_GRM_Series; Order_Code_Digikey: 490-7612-2-ND; Order_Code_Farnell: N/A; Order_Code_RS: N/A; ComponentLink1Description: Part_Information; Alternate_Manufacturer: N/A; Alternate_Manufacturer_Part_Number: N/A
C29 C30 C32 C38 C56 C184 C199 = MCD-00099: Capacitor, MLCC, 10uF, 10V, X5R, +/-10%, 0603, T=0,8mm; Manufacturer_Part_Number: GRM188R61A106KE69D; Manufacturer: MURATA; Part_Preference: Recommended; Order_Code_RS: 170-6168; Component_Country_Of_Origin: Japan; ID: 2770; ShowFields: YES; Internal_Part_Number: MCD-00099; Status: Released; Part_Type: Capacitor; Package: 0603; ComponentLink1Description: Part_Information; ComponentLink1URL: http://tunmcdsvn.tun.st.com/Component_Documentation_Library/Trunk/Capacitor/MURATA_GRM_Series; Order_Code_Digikey: 490-10474-1-ND; Order_Code_Farnell: 2494233; Alternate_Manufacturer: N/A; Alternate_Manufacturer_Part_Number: N/A
C39 C43 C188 C213 C216 = MCD-00095: Capacitor, MLCC, 1uF, 25V, X5R, +/-10%, 0402, T=0.5mm; Part_Preference: Recommended; Manufacturer: MURATA; Manufacturer_Part_Number: GRM155R61E105KA12; Order_Code_RS: 846-7287; Component_Country_Of_Origin: Japan; ShowFields: YES; ID: 2772; Internal_Part_Number: MCD-00095; Status: Released; Part_Type: Capacitor; Package: 0402; ComponentLink1URL: http://tunmcdsvn.tun.st.com/Component_Documentation_Library/Trunk/Capacitor/MURATA_GRM_Series; Order_Code_Digikey: 490-10017-1-ND; Order_Code_Farnell: 2218855
C40 = MCD-03140: Capacitor, MLCC, 10uF, 6.3V, X5R, +/-20%, 0402, T=0.5mm; Part_Preference: Recommended; Manufacturer: MURATA; Manufacturer_Part_Number: GRM155R60J106ME05D; ShowFields: YES; ID: 5256; Component_Country_Of_Origin: China, Japan; Internal_Part_Number: MCD-03140; Status: Checked; Part_Type: Capacitor; Package: 0402; ComponentLink1URL: http://tunmcdsvn.tun.st.com/Component_Documentation_Library/Trunk/Capacitor/MURATA_GRM_Series; Order_Code_Digikey: 490-GRM155R60J106ME05DTR-ND; Order_Code_Farnell: 3784428; Order_Code_RS: N/A
C42 C147 = MCD-01796: Capacitor, Tantalum, 100uF, 6V3, 40mR, +/-20%,  Type_B (3528 metric), T=1.9mm; Part_Preference: Recommended; Manufacturer: AVX; Manufacturer_Part_Number: TCJB107M006R0040; Component_Country_Of_Origin: Lanskroun; ShowFields: YES; ID: 3896; Revision: July-2002: Re-released for DXP Platform.; Internal_Part_Number: MCD-01796; Status: Released; Part_Type: Capacitor; Package: 3528 (metric); ComponentLink1URL: http://tunmcdsvn.tun.st.com/Component_Documentation_Library/Trunk/Capacitor/AVX_TCJ_Series; Order_Code_Digikey: 478-9994-2-ND; Order_Code_Farnell: 2728622; Order_Code_RS: N/A
C61 C91 C189 C190 C208 C209 C214 C215 C217 = MCD-01356: Capacitor, MLCC, 4.7uF, 6V3, X5R, +/-20%, 0402, T=0.5mm; Manufacturer_Part_Number: GRM155R60J475ME47; Manufacturer: MURATA; Part_Preference: Recommended; Order_Code_RS: 814-5230; Component_Country_Of_Origin: Japan; ShowFields: YES; ID: 3456; Internal_Part_Number: MCD-01356; Status: Released; Part_Type: Capacitor; Package: 0402; ComponentLink1URL: http://tunmcdsvn.tun.st.com/Component_Documentation_Library/Trunk/Capacitor/MURATA_GRM_Series; Order_Code_Digikey: 490-5915-1-ND; Order_Code_Farnell: 2666407
C185-C187 C193 C194 C198 C203 C204 C206 C207 = MCD-03139: Capacitor, MLCC, 22uF, 10V, X5R, +/-20%, 0805, T=1,25mm; Part_Preference: Recommended; Manufacturer: MURATA; Manufacturer_Part_Number: GRM21BR61A226ME51L; ShowFields: YES; ID: 5255; Component_Country_Of_Origin: China, Japan; Internal_Part_Number: MCD-03139; Status: Checked; Part_Type: Capacitor; Package: 0805; ComponentLink1URL: http://tunmcdsvn.tun.st.com/Component_Documentation_Library/Trunk/Capacitor/MURATA_GRM_Series; Order_Code_Digikey: 490-10511-2-ND; Order_Code_Farnell: 2494270; Order_Code_RS: N/A
C219 = MCD-02198: Capacitor, MLCC, 10nF, 50V, X7R, +/-10%, 0402, T=0.5mm; Manufacturer_Part_Number: CC0402KRX7R9BB103; Manufacturer: YAGEO; Part_Preference: Recommended; Order_Code_RS: 6169644; Component_Country_Of_Origin: China; ShowFields: YES; ID: 4298; Internal_Part_Number: MCD-02198; Status: Checked; Part_Type: Capacitor; Package: 0402; ComponentLink1URL: http://tunmcdsvn.tun.st.com/Component_Documentation_Library/Trunk/Capacitor/YAGEO_X7R_Series; Order_Code_Digikey: N/A; Order_Code_Farnell: N/A
L1 L6 = MCD-03143: Inductor, 2.2uH, +/-20%, Itemp= 1700mA, Isat= 2400mA, 0R140, 0806, T=1mm; Part_Preference: Recommended; Manufacturer: MURATA; Manufacturer_Part_Number: DFE201610E-2R2M=P2; ShowFields: YES; ID: 5259; Component_Country_Of_Origin: Vietnam; Internal_Part_Number: MCD-03143; Status: Checked; Part_Type: Inductor; Package: 0806; ComponentLink1URL: http://tunmcdsvn.tun.st.com/Component_Documentation_Library/Trunk/Inductor/MURATA_DFE201610E_Series; Order_Code_Digikey: 490-17728-2-ND -; Order_Code_Farnell: N/A; Order_Code_RS: N/A
L2 L4 = MCD-03142: Inductor, 0.68uH, +/-20%, Itemp= 3900mA, Isat= 5400mA, 0R031, 1008, T=1.2mm; Part_Preference: Recommended; Manufacturer: MURATA; Manufacturer_Part_Number: DFE252012F-R68M=P2; ShowFields: YES; ID: 5258; Component_Country_Of_Origin: Vietnam; Internal_Part_Number: MCD-03142; Status: Checked; Part_Type: Inductor; Package: 1008; ComponentLink1URL: http://tunmcdsvn.tun.st.com/Component_Documentation_Library/Trunk/Inductor/MURATA_DFE252012F-6R8M=P2; Order_Code_Digikey: 490-13044-2-ND; Order_Code_Farnell: N/A; Order_Code_RS: N/A
L3 L5 L7 = MCD-03141: Inductor, 0.68uH, +/-20%, Itemp= 3100mA, Isat= 4300mA, 0R043, 0806, T=1mm; Part_Preference: Recommended; Manufacturer: MURATA; Manufacturer_Part_Number: DFE201610E-R68M=P2; ShowFields: YES; ID: 5257; Component_Country_Of_Origin: Vietnam; Internal_Part_Number: MCD-03141; Status: Checked; Part_Type: Inductor; Package: 0806; ComponentLink1URL: http://tunmcdsvn.tun.st.com/Component_Documentation_Library/Trunk/Inductor/MURATA_DFE201610E_Series; Order_Code_Digikey: N/A; Order_Code_Farnell: N/A; Order_Code_RS: N/A
LD11 = MCD-00588: LED Green, 0603 SMD, Forward Voltage Typ=2V, Max=2.5V; Part_Type: Display; Manufacturer_Part_Number: LG Q396-PS-35; Manufacturer: OSRAM OPTO SEMICONDUCTORS; Alternate_Manufacturer_Part_Number: VLMTG1300-GS08; Alternate_Manufacturer: VISHAY SEMICONDUCTOR OPTO DIVISION; Alternate_Internal_Part_Number: MCD-02400; Part_Preference: Recommended; Provided_By: SUBCO; Component_Country_Of_Origin: Unknown; ID: 3155; ShowFields: YES; Internal_Part_Number: MCD-00588; Status: Released; Package: LED 0603; ComponentLink1Description: Datasheet; ComponentLink1URL: http://tunmcdsvn.tun.st.com/Component_Documentation_Library/Trunk/Display/OSRAM_OPTO_SEMICONDUCTORS_LG-Q396-PS-35; Order_Code_Digikey: LG Q396-PS-35-ND; ECCN_US: n/a; ECCN_EU: n/a; Order_Code_Farnell: N/A; Order_Code_RS: N/A; Full_Alternate_Internal_Part_Number: MCD-02400
LNK1 LNK2 LNK4 LNK7 LNK8 LNK11 = MCD-02777: Track link on PCB 200um width for layout routing; Part_Preference: Recommended; Part_Type: Misc; ID: 4889; ShowFields: YES; Value: link_200; ComponentLink1URL: http://tunmcdsvn.tun.st.com/Component_Documentation_Library/Trunk; Internal_Part_Number: MCD-02777; Manufacturer: N/A; Manufacturer_Part_Number: link_200; Order_Code_Digikey: N/A; Order_Code_Farnell: N/A; Order_Code_RS: N/A; Status: Checked
R46 R57 R59-R61 R81 = MCD-00052: Resistor,0R,0402,5%,1/16W; Manufacturer_Part_Number: RC0402JR-070RL; Manufacturer: YAGEO; Part_Preference: Recommended; ECCN_US: EAR99; ECCN_EU: NEC; Provided_By: SUBCO; Initial_Board_Reference: mb1274; Order_Code_RS: 618-5804; Component_Country_Of_Origin: China; ID: 2540; ShowFields: YES; Internal_Part_Number: MCD-00052; ComponentLink1Description: Datasheet; Status: Released; Part_Type: Resistor; ComponentLink1URL: http://tunmcdsvn.tun.st.com/Component_Documentation_Library/Trunk/Resistor/YAGEO_RC_L_Series; Package: 0402; Alternate_Manufacturer: N/A; Alternate_Manufacturer_Part_Number: N/A; Order_Code_Digikey: 311-0.0JRCT-ND; Order_Code_Farnell: 9232516RL
R210 = MCD-00441: Resistor,270R,0402,1%,1/16W; Manufacturer_Part_Number: RC0402FR-07270RL; Manufacturer: YAGEO; Part_Preference: Recommended; Provided_By: SUBCO; ECCN_US: EAR99; ECCN_EU: NEC; Component_Country_Of_Origin: China; ID: 2838; ShowFields: YES; Internal_Part_Number: MCD-00441; Status: Released; Part_Type: Resistor; Package: 0402; ComponentLink1Description: Datasheet; ComponentLink1URL: http://tunmcdsvn.tun.st.com/Component_Documentation_Library/Trunk/Resistor/YAGEO_RC_L_Series; Order_Code_Digikey: 311-270LRCT-ND; Order_Code_Farnell: 9239162; Order_Code_RS: N/A
U26 = MCD-03000: STPMIC2; Part_Type: IC; Part_Preference: Recommended; Manufacturer: STMICROELECTRONICS; Component_Country_Of_Origin: Unknown; ShowFields: YES; ID: 5116; ComponentLink1Description: Datasheet; ComponentLink1URL: http://tunmcdsvn.tun.st.com/Component_Documentation_Library/Trunk/IC/STMICROELECTRONICS_STPMIC2; Internal_Part_Number: MCD-03000; Value: STPMIC25APQR; Status: Released; Manufacturer_Part_Number: STPMIC25APQR; Package: VQFN; Order_Code_Digikey: N/A; Order_Code_Farnell: N/A; Order_Code_RS: N/A

## Sheet STM32MP25XXAK Power.SchDoc: Power MPU
size A3; Date: Not used; ApprovedBy: Not used; CheckedBy: Not used; Author: Not used; CompanyName: STMicroelectronics; DrawnBy: Not used; Engineer: Not used; Organization: Not used; Address1: Not used; Address2: Not used; Address3: Not used; Address4: Not used; DocumentNumber: Not used; Revision: Not used; SheetNumber: 5; SheetTotal: 7; CurrentTime: Not used; CurrentDate: Not used; Time: Not used; DocumentFullPathAndName: Not used; DocumentName: Not used; ModifiedDate: Not used; ImagePath: Not used; ProjectName: Not used; Application_BuildNumber: Not used
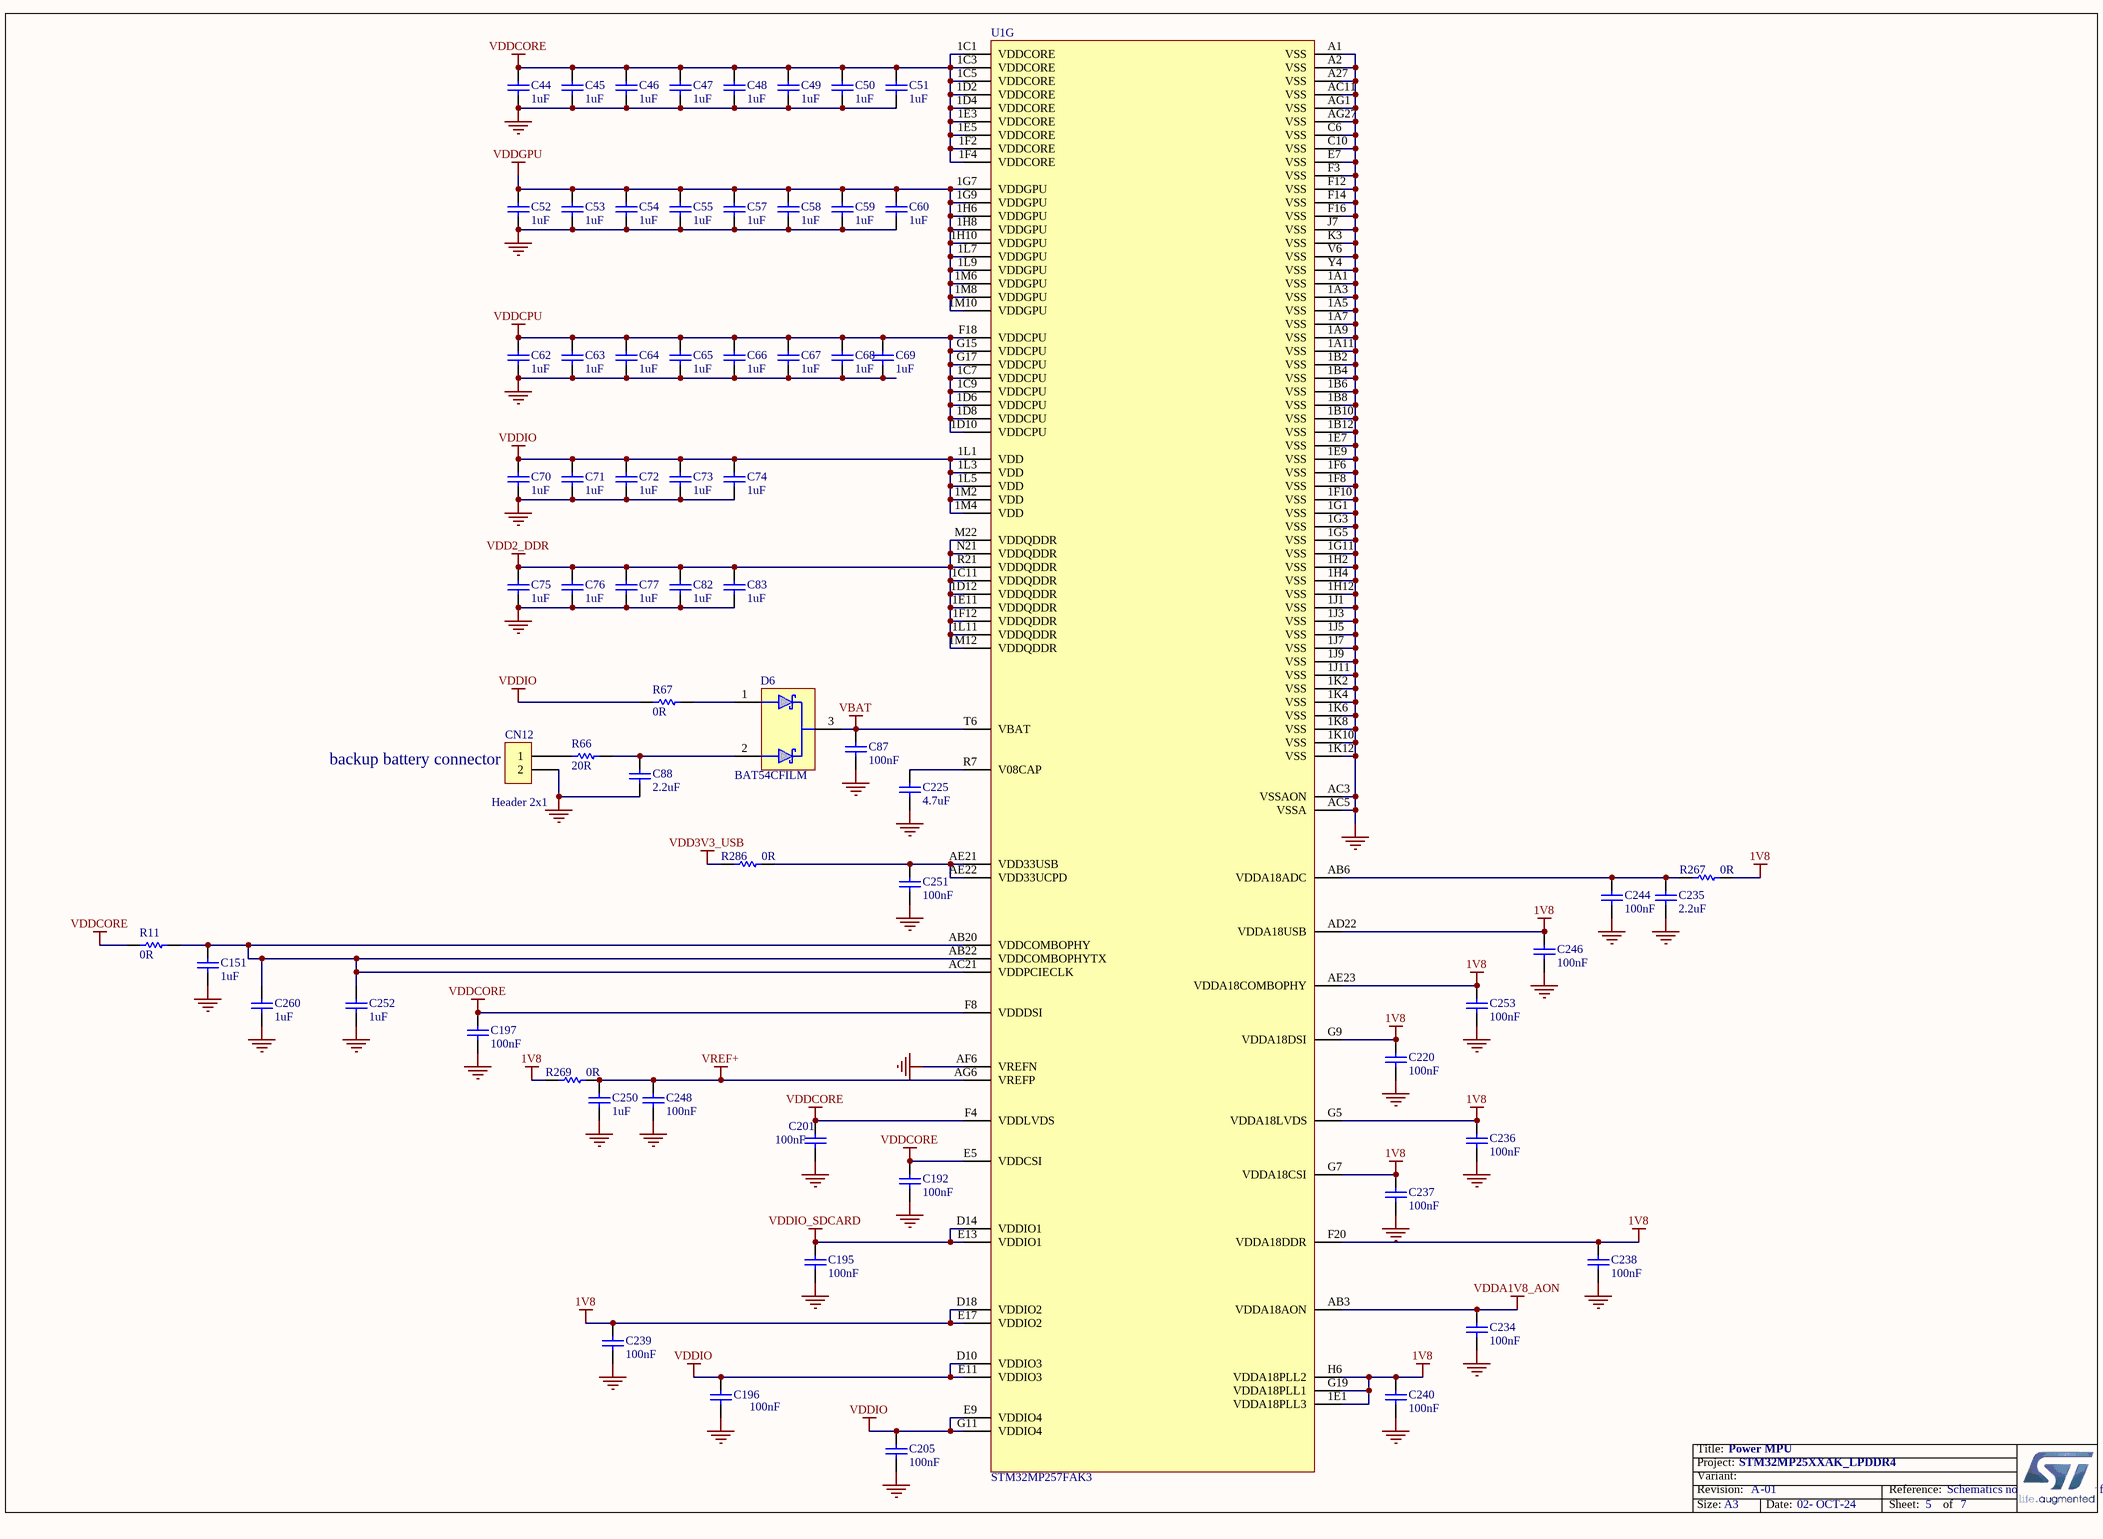
[diagram p4: STM32MP25XXAK Power.SchDoc]

### Parts
C44  1uF  [C0201_MURATA_GRM033_H0P3]
C45  1uF  [C0201_MURATA_GRM033_H0P3]
C46  1uF  [C0201_MURATA_GRM033_H0P3]
C47  1uF  [C0201_MURATA_GRM033_H0P3]
C48  1uF  [C0201_MURATA_GRM033_H0P3]
C49  1uF  [C0201_MURATA_GRM033_H0P3]
C50  1uF  [C0201_MURATA_GRM033_H0P3]
C51  1uF  [C0201_MURATA_GRM033_H0P3]
C52  1uF  [C0201_MURATA_GRM033_H0P3]
C53  1uF  [C0201_MURATA_GRM033_H0P3]
C54  1uF  [C0201_MURATA_GRM033_H0P3]
C55  1uF  [C0201_MURATA_GRM033_H0P3]
C57  1uF  [C0201_MURATA_GRM033_H0P3]
C58  1uF  [C0201_MURATA_GRM033_H0P3]
C59  1uF  [C0201_MURATA_GRM033_H0P3]
C60  1uF  [C0201_MURATA_GRM033_H0P3]
C62  1uF  [C0201_MURATA_GRM033_H0P3]
C63  1uF  [C0201_MURATA_GRM033_H0P3]
C64  1uF  [C0201_MURATA_GRM033_H0P3]
C65  1uF  [C0201_MURATA_GRM033_H0P3]
C66  1uF  [C0201_MURATA_GRM033_H0P3]
C67  1uF  [C0201_MURATA_GRM033_H0P3]
C68  1uF  [C0201_MURATA_GRM033_H0P3]
C69  1uF  [C0201_MURATA_GRM033_H0P3]
C70  1uF  [C0201_MURATA_GRM033_H0P3]
C71  1uF  [C0201_MURATA_GRM033_H0P3]
C72  1uF  [C0201_MURATA_GRM033_H0P3]
C73  1uF  [C0201_MURATA_GRM033_H0P3]
C74  1uF  [C0201_MURATA_GRM033_H0P3]
C75  1uF  [C0201_MURATA_GRM033_H0P3]
C76  1uF  [C0201_MURATA_GRM033_H0P3]
C77  1uF  [C0201_MURATA_GRM033_H0P3]
C82  1uF  [C0201_MURATA_GRM033_H0P3]
C83  1uF  [C0201_MURATA_GRM033_H0P3]
C87  value 100nF  [C0402]
C88  value 2.2uF  [C0402]  (hidden comment: Capacitor)
C151  value 1uF  [C0201_MURATA_GRM033_H0P3]  (hidden comment: Capacitor)
C192  value 100nF  [C0201_MURATA_GRM033_H0P3]  (hidden comment: Capacitor)
C195  value 100nF  [C0201_MURATA_GRM033_H0P3]  (hidden comment: Capacitor)
C196  value 100nF  [C0201_MURATA_GRM033_H0P3]  (hidden comment: Capacitor)
C197  value 100nF  [C0201_MURATA_GRM033_H0P3]  (hidden comment: Capacitor)
C201  value 100nF  [C0201_MURATA_GRM033_H0P3]  (hidden comment: Capacitor)
C205  value 100nF  [C0201_MURATA_GRM033_H0P3]  (hidden comment: Capacitor)
C220  value 100nF  [C0201_MURATA_GRM033_H0P3]  (hidden comment: Capacitor)
C225  value 4.7uF  [C0201_H0P5]  (hidden comment: Capacitor)
C234  value 100nF  [C0201_MURATA_GRM033_H0P3]  (hidden comment: Capacitor)
C235  value 2.2uF  [C0201_H0P5]  (hidden comment: Capacitor)
C236  value 100nF  [C0201_MURATA_GRM033_H0P3]  (hidden comment: Capacitor)
C237  value 100nF  [C0201_MURATA_GRM033_H0P3]  (hidden comment: Capacitor)
C238  value 100nF  [C0201_MURATA_GRM033_H0P3]  (hidden comment: Capacitor)
C239  value 100nF  [C0201_MURATA_GRM033_H0P3]  (hidden comment: Capacitor)
C240  value 100nF  [C0201_MURATA_GRM033_H0P3]  (hidden comment: Capacitor)
C244  value 100nF  [C0201_MURATA_GRM033_H0P3]  (hidden comment: Capacitor)
C246  value 100nF  [C0201_MURATA_GRM033_H0P3]  (hidden comment: Capacitor)
C248  value 100nF  [C0201_MURATA_GRM033_H0P3]  (hidden comment: Capacitor)
C250  value 1uF  [C0201_MURATA_GRM033_H0P3]  (hidden comment: Capacitor)
C251  value 100nF  [C0201_MURATA_GRM033_H0P3]  (hidden comment: Capacitor)
C252  value 1uF  [C0201_MURATA_GRM033_H0P3]  (hidden comment: Capacitor)
C253  value 100nF  [C0201_MURATA_GRM033_H0P3]  (hidden comment: Capacitor)
C260  value 1uF  [C0201_MURATA_GRM033_H0P3]  (hidden comment: Capacitor)
CN12  value Header 2x1  [CON_MOLEX_53047-0210]
D6  value BAT54CFILM  [DIO_SOT23]  (hidden comment: DIODE_3P_DUAL_COMMON_CATHODE)
R11  value 0R  [R0603]  (hidden comment: Resistor)
R66  value 20R  [R0402]  (hidden comment: Resistor)
R67  value 0R  [R0402]  (hidden comment: Resistor)
R267  value 0R  [R0402]
R269  value 0R  [R0402]
R286  value 0R  [R0402]
U1  STM32MP257FAK3  [ICC_TFBGA424_14X14_P050_H1P20_CODE-B0A2]  (part G of 9)

### Nets
1V8: C220.2 C236.2 C237.2 C238.2 C239.2 C240.2 C246.2 C253.2 R267.2 R269.1 U1.1E1(VDDA18PLL3) U1.AD22(VDDA18USB) U1.AE23(VDDA18COMBOPHY) U1.D18(VDDIO2) U1.E17(VDDIO2) U1.F20(VDDA18DDR) U1.G5(VDDA18LVDS) U1.G7(VDDA18CSI) U1.G9(VDDA18DSI) U1.G19(VDDA18PLL1) U1.H6(VDDA18PLL2)
GND: C44.2 C45.1 C46.1 C47.2 C48.1 C49.1 C50.1 C51.1 C52.1 C53.1 C54.1 C55.1 C57.1 C58.1 C59.1 C60.1 C62.2 C63.1 C64.1 C65.2 C66.1 C67.1 C68.1 C69.1 C70.2 C71.1 C72.1 C73.2 C74.1 C75.1 C76.1 C77.2 C82.1 C83.1 C87.1 C88.1 C151.1 C192.1 C195.1 C196.1 C197.1 C201.1 C205.1 C220.1 C225.1 C234.1 C235.1 C236.1 C237.1 C238.1 C239.1 C240.1 C244.1 C246.1 C248.1 C250.1 C251.1 C252.1 C253.1 C260.1 CN12.2 U1.1A1(VSS) U1.1A3(VSS) U1.1A5(VSS) U1.1A7(VSS) U1.1A9(VSS) U1.1A11(VSS) U1.1B2(VSS) U1.1B4(VSS) U1.1B6(VSS) U1.1B8(VSS) U1.1B10(VSS) U1.1B12(VSS) U1.1E7(VSS) U1.1E9(VSS) U1.1F6(VSS) U1.1F8(VSS) U1.1F10(VSS) U1.1G1(VSS) U1.1G3(VSS) U1.1G5(VSS) U1.1G11(VSS) U1.1H2(VSS) U1.1H4(VSS) U1.1H12(VSS) U1.1J1(VSS) U1.1J3(VSS) U1.1J5(VSS) U1.1J7(VSS) U1.1J9(VSS) U1.1J11(VSS) U1.1K2(VSS) U1.1K4(VSS) U1.1K6(VSS) U1.1K8(VSS) U1.1K10(VSS) U1.1K12(VSS) U1.A1(VSS) U1.A2(VSS) U1.A27(VSS) U1.AC3(VSSAON) U1.AC5(VSSA) U1.AC11(VSS) U1.AF6(VREFN) U1.AG1(VSS) U1.AG27(VSS) U1.C6(VSS) U1.C10(VSS) U1.E7(VSS) U1.F3(VSS) U1.F12(VSS) U1.F14(VSS) U1.F16(VSS) U1.J7(VSS) U1.K3(VSS) U1.V6(VSS) U1.Y4(VSS)
VBAT: C87.2 D6.3 U1.T6(VBAT)
VDD2_DDR: C75.2 C76.2 C77.1 C82.2 C83.2 U1.1C11(VDDQDDR) U1.1D12(VDDQDDR) U1.1E11(VDDQDDR) U1.1F12(VDDQDDR) U1.1L11(VDDQDDR) U1.1M12(VDDQDDR) U1.M22(VDDQDDR) U1.N21(VDDQDDR) U1.R21(VDDQDDR)
VDD3V3_USB: R286.1
VDDA1V8_AON: C234.2 U1.AB3(VDDA18AON)
VDDCORE: C44.1 C45.2 C46.2 C47.1 C48.2 C49.2 C50.2 C51.2 C192.2 C197.2 C201.2 R11.1 U1.1C1(VDDCORE) U1.1C3(VDDCORE) U1.1C5(VDDCORE) U1.1D2(VDDCORE) U1.1D4(VDDCORE) U1.1E3(VDDCORE) U1.1E5(VDDCORE) U1.1F2(VDDCORE) U1.1F4(VDDCORE) U1.E5(VDDCSI) U1.F4(VDDLVDS) U1.F8(VDDDSI)
VDDCPU: C62.1 C63.2 C64.2 C65.1 C66.2 C67.2 C68.2 C69.2 U1.1C7(VDDCPU) U1.1C9(VDDCPU) U1.1D6(VDDCPU) U1.1D8(VDDCPU) U1.1D10(VDDCPU) U1.F18(VDDCPU) U1.G15(VDDCPU) U1.G17(VDDCPU)
VDDGPU: C52.2 C53.2 C54.2 C55.2 C57.2 C58.2 C59.2 C60.2 U1.1G7(VDDGPU) U1.1G9(VDDGPU) U1.1H6(VDDGPU) U1.1H8(VDDGPU) U1.1H10(VDDGPU) U1.1L7(VDDGPU) U1.1L9(VDDGPU) U1.1M6(VDDGPU) U1.1M8(VDDGPU) U1.1M10(VDDGPU)
VDDIO: C70.1 C71.2 C72.2 C73.1 C74.2 C196.2 C205.2 R67.2 U1.1L1(VDD) U1.1L3(VDD) U1.1L5(VDD) U1.1M2(VDD) U1.1M4(VDD) U1.D10(VDDIO3) U1.E9(VDDIO4) U1.E11(VDDIO3) U1.G11(VDDIO4)
VDDIO_SDCARD: C195.2 U1.D14(VDDIO1) U1.E13(VDDIO1)
VREF+: C248.2 C250.2 R269.2 U1.AG6(VREFP)
NetC88_2: C88.2 D6.2 R66.2
NetC151_2: C151.2 C252.2 C260.2 R11.2 U1.AB20(VDDCOMBOPHY) U1.AB22(VDDCOMBOPHYTX) U1.AC21(VDDPCIECLK)
NetC225_2: C225.2 U1.R7(V08CAP)
NetC235_2: C235.2 C244.2 R267.1 U1.AB6(VDDA18ADC)
NetC251_2: C251.2 R286.2 U1.AE21(VDD33USB) U1.AE22(VDD33UCPD)
NetCN12_1: CN12.1 R66.1
NetD6_1: D6.1 R67.1

### Notes on the sheet
- (near CN12) backup battery connector
- Title:
- Project:
- Size:
- Revision:
- Variant:
- A3
- -
- Date:
- Reference:
- Sheet:
- of

### Library data of the parts
C44-C55 C57-C60 C62-C77 C82 C83 = MCD-02377: Capacitor, MLCC, 1uF, 6.3V, X5R, +/-20%, 0201, T=0,3mm; Part_Preference: Recommended; Manufacturer: MURATA; Manufacturer_Part_Number: GRM033R60J105MEA2; Order_Code_RS: 820-0643; Component_Country_Of_Origin: Japan; ShowFields: YES; ID: 4483; Status: Checked; Value: 1uF; Internal_Part_Number: MCD-02377; Part_Type: Capacitor; Package: 0201; ComponentLink1URL: http://tunmcdsvn.tun.st.com/Component_Documentation_Library/Trunk/Capacitor/MURATA_GRM_Series/GRM033R60J105MEA2/; Order_Code_Digikey: 490-7229-2-ND; Order_Code_Farnell: 2470448
C87 = MCD-00006: Capacitor,100nF,16V,X7R,10%,0402; Manufacturer_Part_Number: CC0402KRX7R7BB104; Manufacturer: YAGEO; Alternate_Manufacturer: MURATA; Alternate_Manufacturer_Part_Number: GCM155R71C104KA55D; Part_Preference: Recommended; Partial_Alternate_Internal_Part_Number: MCD-03299; Provided_By: SUBCO; Initial_Board_Reference: MB1274; Order_Code_RS: 616-9701; Component_Country_Of_Origin: China; ID: 2474; ShowFields: YES; Alternate_EMS: M; Internal_Part_Number: MCD-00006; ComponentLink1Description: Datasheet; ECCN_US: n/a; ECCN_EU: n/a; Status: Released; Part_Type: Capacitor; Package: 0402; ComponentLink1URL: http://tunmcdsvn.tun.st.com/Component_Documentation_Library/Trunk/Capacitor/YAGEO_X7R_Series; Order_Code_Digikey: 311-1338-1-ND; Order_Code_Farnell: 9402047
C88 = MCD-01823: Capacitor, MLCC, 2.2uF, 6V3, X5R,+/-10%, 0402, T=0.5mm; Part_Preference: Recommended; Manufacturer: MURATA; Manufacturer_Part_Number: GRM155R60J225KE95D; Order_Code_RS: 172-6478; Component_Country_Of_Origin: Japan; ID: 3923; ShowFields: YES; Internal_Part_Number: MCD-01823; Status: Released; Part_Type: Capacitor; Alternate_Manufacturer: N/A; Alternate_Manufacturer_Part_Number: N/A; Package: 0402; ComponentLink1URL: http://tunmcdsvn.tun.st.com/Component_Documentation_Library/Trunk/Capacitor/MURATA_GRM_Series; Order_Code_Digikey: 490-12532-1-ND; Order_Code_Farnell: 2695865
C151 C250 C252 C260 = MCD-02377: Capacitor, MLCC, 1uF, 6.3V, X5R, +/-20%, 0201, T=0,3mm; Manufacturer_Part_Number: GRM033R60J105MEA2; Manufacturer: MURATA; Part_Preference: Recommended; Order_Code_RS: 820-0643; Component_Country_Of_Origin: Japan; ID: 4483; ShowFields: YES; Status: Checked; Internal_Part_Number: MCD-02377; Part_Type: Capacitor; Alternate_Manufacturer_Part_Number: N/A; Alternate_Manufacturer: N/A; Package: 0201; ComponentLink1URL: http://tunmcdsvn.tun.st.com/Component_Documentation_Library/Trunk/Capacitor/MURATA_GRM_Series/GRM033R60J105MEA2/; Order_Code_Digikey: 490-7229-2-ND; Order_Code_Farnell: 2470448
C192 C195-C197 C201 C205 C220 C234 C236-C240 C244 C246 C248 C251 C253 = MCD-01535: Capacitor, MLCC,100nF, 10V, X7R, +/-10%, 0201, T=0.3mm; Part_Preference: Recommended; Manufacturer: MURATA; Manufacturer_Part_Number: GRM033R61A104KE15; Order_Code_RS: 790-2742; Component_Country_Of_Origin: Japan; ID: 3635; ShowFields: YES; Internal_Part_Number: MCD-01535; Status: Checked; Part_Type: Capacitor; Alternate_Manufacturer: N/A; Alternate_Manufacturer_Part_Number: N/A; Package: 0201; ComponentLink1URL: http://tunmcdsvn.tun.st.com/Component_Documentation_Library/Trunk/Capacitor/MURATA_GRM_Series; Order_Code_Digikey: 490-5881-1-ND; Order_Code_Farnell: 2470450
C225 = MCD-01534: Capacitor, MLCC, 4,7uF, 6V3, X5R, +/-20%, 0201, T=0.5mm; Part_Preference: Recommended; Manufacturer: MURATA; Manufacturer_Part_Number: GRM035R60J475ME15; Component_Country_Of_Origin: Japan; ID: 3634; ShowFields: YES; Internal_Part_Number: MCD-01534; Status: Checked; Part_Type: Capacitor; Alternate_Manufacturer: N/A; Alternate_Manufacturer_Part_Number: N/A; Package: 0201; ComponentLink1URL: http://tunmcdsvn.tun.st.com/Component_Documentation_Library/Trunk/Capacitor/MURATA_GRM_Series; Order_Code_Digikey: 490-13230-1-ND; Order_Code_Farnell: N/A; Order_Code_RS: N/A
C235 = MCD-02235: Capacitor, MLCC, 2.2uF, 10V, X5R,+/-10%, 0201, T=0.5mm; Part_Preference: Recommended; Manufacturer: MURATA; Manufacturer_Part_Number: GRM033R61A225KE47D; Order_Code_RS: NA; Component_Country_Of_Origin: Japan; ShowFields: YES; ID: 4335; Internal_Part_Number: MCD-02235; Status: Checked; Part_Type: Capacitor; Package: 0201; ComponentLink1URL: http://tunmcdsvn.tun.st.com/Component_Documentation_Library/Trunk/Capacitor/MURATA_GRM_Series; Order_Code_Digikey: 490-13227-1-ND; Order_Code_Farnell: NA
CN12 = MCD-00655: Header 2 circuits, 1.25mm Pitch ,  Vertical, with Friction Lock; Part_Type: Connector; Manufacturer_Part_Number: 53047-0210; Manufacturer: MOLEX; BMS_Part_Number: 9083002; Part_Preference: Recommended; Provided_By: SUBCO; Initial_Board_Reference: MB1272; Order_Code_RS: 279-9213; Component_Country_Of_Origin: Unknown; ID: 3091; ShowFields: YES; Internal_Part_Number: MCD-00655; Status: Released; ComponentLink1Description: Datasheet; ComponentLink1URL: http://tunmcdsvn.tun.st.com/Component_Documentation_Library/Trunk/Connector/MOLEX_53047-0210/; ECCN_US: n/a; ECCN_EU: n/a; Alternate_Manufacturer: N/A; Alternate_Manufacturer_Part_Number: N/A; Order_Code_Digikey: WM1731-ND; Order_Code_Farnell: 9733051
D6 = MCD-03280: Diode, Schottky, Dual Common Cathode, 0V3, 300mA, 40V, SOT-23; Part_Preference: Recommended; Manufacturer: STMICROELECTRONICS; Full_Alternate_Internal_Part_Number: BAT54C+, BAT54CLT1G, BAT54C-7-F, BAT54C,215; Order_code_RS: 795-8397; Component_Country_Of_Origin: China; ShowFields: YES; ID: 5396; Order_code_Digikey: N/A; Order_code_Farnell: 9801499; Status: New; ComponentLink1URL: http://tunmcdsvn.tun.st.com/Component_Documentation_Library/Trunk/Diode/STMICROELECTRONICS_BAT54_Series; Internal_Part_Number: MCD-03280; Part_Type: Diode; Manufacturer_Part_Number: BAT54CFILM; Package: SOT-23
R11 = MCD-00056: Resistor, 0R, 0603, +/-5%, 1/10W; Part_Preference: Recommended; Manufacturer: YAGEO; Manufacturer_Part_Number: RC0603JR-070RL; Component_Country_Of_Origin: China; ShowFields: YES; ID: 2536; Internal_Part_Number: MCD-00056; Status: Released; Part_Type: Resistor; Package: 0603; ComponentLink1URL: http://tunmcdsvn.tun.st.com/Component_Documentation_Library/Trunk/Resistor/YAGEO_RC_L_Series; Order_Code_Digikey: 311-0.0GRCT-ND; Order_Code_Farnell: 9233130RL; Order_Code_RS: N/A
R66 = MCD-00058: Resistor, 20R, 0402, +/-1%, 1/16W; BMS_Part_Number: 9131027; Part_Preference: Recommended; Manufacturer: YAGEO; Manufacturer_Part_Number: RC0402FR-0720RL; Component_Country_Of_Origin: China; ID: 2537; ShowFields: YES; Internal_Part_Number: MCD-00058; Status: Released; Part_Type: Resistor; Alternate_Manufacturer: N/A; Alternate_Manufacturer_Part_Number: N/A; Package: 0402; ComponentLink1URL: http://tunmcdsvn.tun.st.com/Component_Documentation_Library/Trunk/Resistor/YAGEO_RC_L_Series; Order_Code_Digikey: 311-20LRCT-ND; Order_Code_Farnell: 1799192; Order_Code_RS: N/A
R67 = MCD-00052: Resistor, 0R, 0402, +/-5%, 1/16W; Manufacturer_Part_Number: RC0402JR-070RL; Manufacturer: YAGEO; Part_Preference: Recommended; Order_Code_RS: 618-5804; Component_Country_Of_Origin: China; ShowFields: YES; ID: 2540; Internal_Part_Number: MCD-00052; Status: Released; Part_Type: Resistor; ComponentLink1URL: http://tunmcdsvn.tun.st.com/Component_Documentation_Library/Trunk/Resistor/YAGEO_RC_L_Series; Package: 0402; Order_Code_Digikey: 311-0.0JRCT-ND; Order_Code_Farnell: 9232516RL
R267 R269 R286 = MCD-00052: as R46 on sheet PMIC; Internal_Part_Number: MCD-00052; ComponentLink1Description: Datasheet; Status: Released; Part_Type: Resistor; ComponentLink1URL: http://tunmcdsvn.tun.st.com/Component_Documentation_Library/Trunk/Resistor/YAGEO_RC_L_Series; Package: 0402; Alternate_Manufacturer: N/A; Alternate_Manufacturer_Part_Number: N/A; Order_Code_Digikey: 311-0.0JRCT-ND; Order_Code_Farnell: 9232516RL
U1 = MCD-03375: as U1 on sheet STM32MP25XXAK I_Os; Internal_Part_Number: MCD-03375; Value: STM32MP257FAK3; Status: Checked; Manufacturer_Part_Number: STM32MP257FAK3; Package: TFBGA; ComponentLink1URL: http://tunmcdsvn.tun.st.com/Component_Documentation_Library/Trunk/IC/STMICROELECTRONICS_STM32MP257FAK3; Order_Code_Digikey: N/A; Order_Code_Farnell: N/A; Order_Code_RS: N/A